# EasyEDA Pro project AquaEye_2025-09-11.epro

# Schematic Esquema 8266
Board Name: Board1; Create Date: 2024-12-06; Page Name: P1; Project Name: AquaEye-Novo; Schematic Name: Esquema; Update Date: 2024-12-06; Company: EasyEDA.com; Drawn: EasyEDA; Page Size: A4; Part Number: JLCPCB-002; Reviewed: EasyEDA; Version: V0.1
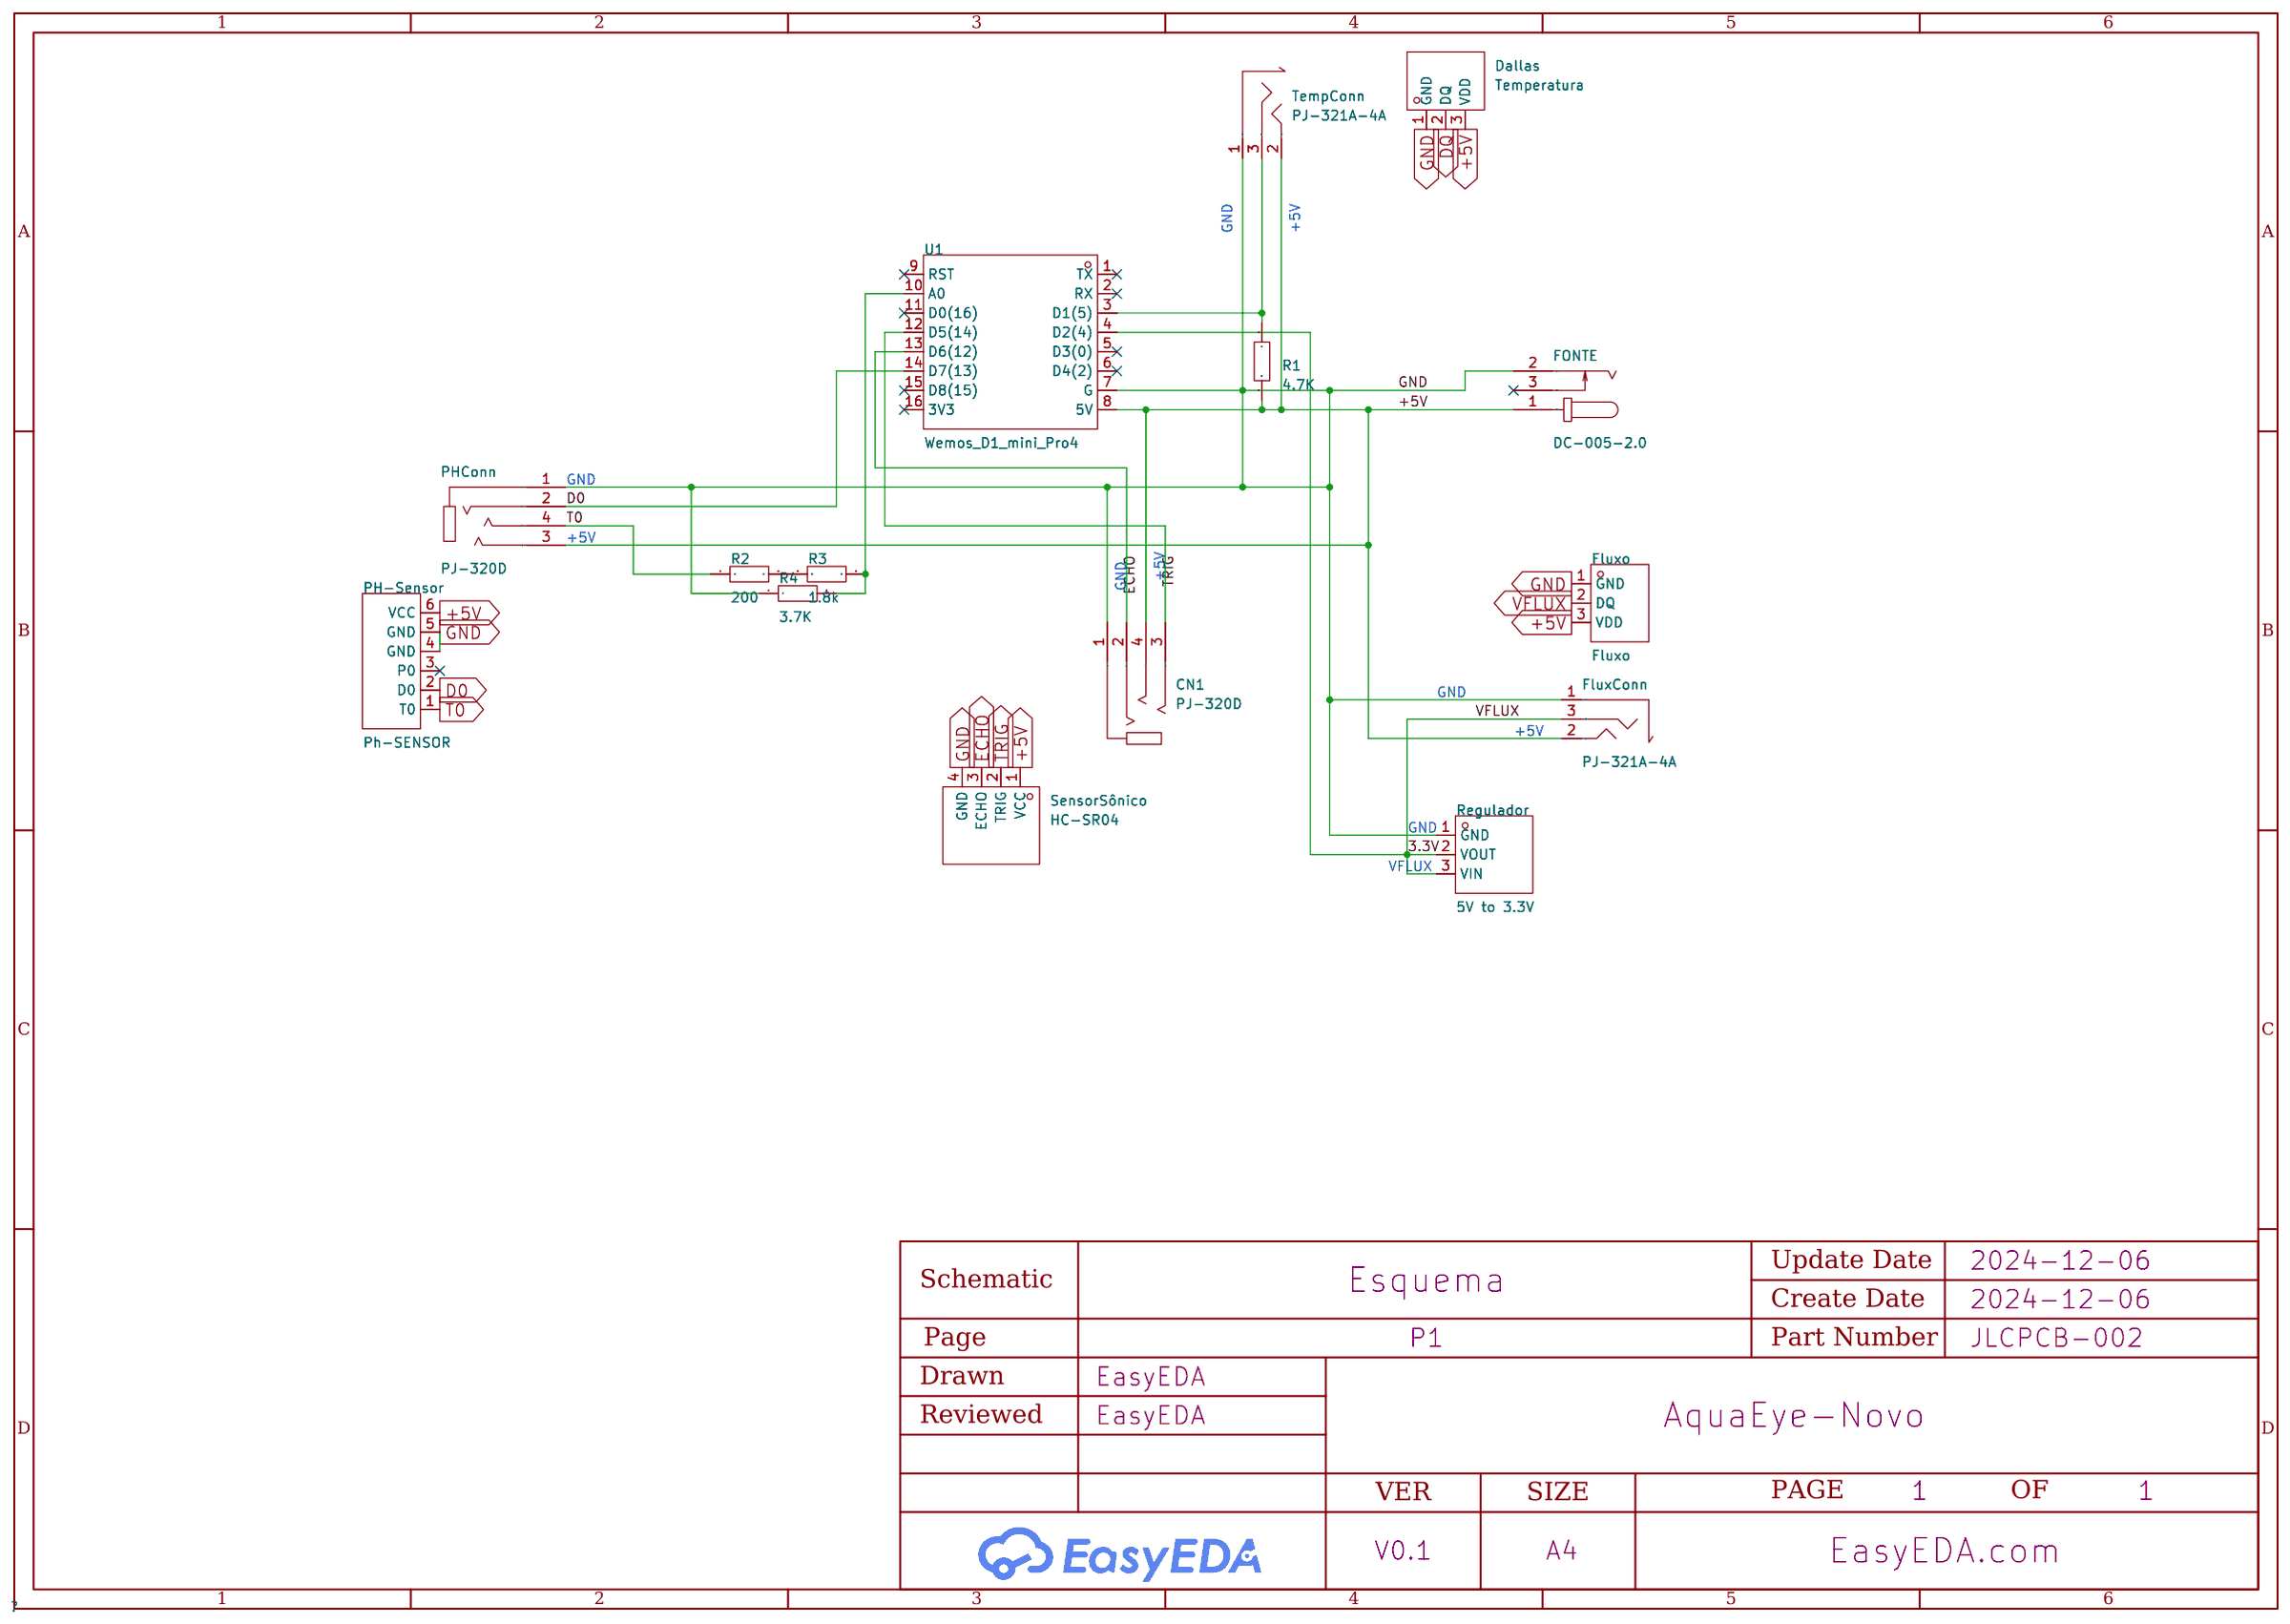
[diagram p0: schematic sheet]

## Parts
CN1  PJ-320D  [AUDIO-SMD_HANELECTRICITY_PJ-320D]
Dallas  Temperatura  [TO-92-SMD_L4.6-W4.6-P1.27_DS18B20]  (no BOM)
FluxConn  PJ-321A-4A  [AUDIO-SMD_PJ-321A-4A]
Fluxo  Fluxo  [TO-92-SMD_L4.6-W4.6-P1.27_DS18B20]  (no BOM)
FONTE  DC-005-2.0  [DC-IN-TH_DC-005-2.0_C22459640]
PH-Sensor  Ph-SENSOR  [PHSENSOR]  (no BOM)
PHConn  PJ-320D  [AUDIO-SMD_HANELECTRICITY_PJ-320D]
R1  4.7K  [R0603]
R2  200  [R0603]
R3  1.8k  [R0603]
R4  3.7K  [R0603]
Regulador  5V to 3.3V  [TO-220-3_L10.0-W4.5-P2.54-L]
SensorSônico  HC-SR04  [TH_HC-SR04V]  (no BOM)
TempConn  PJ-321A-4A  [AUDIO-SMD_PJ-321A-4A]
U1  Wemos_D1_mini_Pro4  [DIP-16_WEMOS_D1_MINI_PRO4]

## Library data of the parts
CN1 PHConn = PJ-320D_C22459515: Supplier Part: C22459515; Manufacturer: HanElectricity(瀚源); Supplier Footprint: SMD; JLCPCB Part Class: Extended Part; Datasheet: https://atta.szlcsc.com/upload/public/pdf/source/20240605/841F5FC54B5C3721768734EDD4CF8D45.pdf; Supplier: LCSC
Dallas Fluxo = DS18B20A10T6: Temperature range:-55℃~+125℃ Temperature range:-55℃~+125℃ Resolution:±0.5℃ Resolution:±0.5℃ Supply Voltage:1.8V~5.5V Supply Voltage:1.8V~5.5V Standby Current:0.2uA Interface Type:-; LCSC Part Name: 数字温度探头; Supplier Part: C22360667; Manufacturer: Mysentech(敏源传感); JLCPCB Part Class: Extended Part; Datasheet: https://atta.szlcsc.com/upload/public/pdf/source/20240403/8816A34B1D539D1E85165E3122908D9D.pdf; Supplier: LCSC; Temperature range: -55℃~+125℃; Resolution: ±0.5℃; Supply Voltage: 1.8V~5.5V; Standby Current: 0.2uA
FluxConn TempConn = PJ-321A-4A: Connector Type:3.5mm耳机座 Current Rating (Max):500mA Voltage Rating (Max):30V Operating Temperature Range:-20℃~+70℃ Operating Temperature Range:-20℃~+70℃; LCSC Part Name: 3.5mm耳机座; Supplier Part: C879743; Manufacturer: 韩国韩荣; Supplier Footprint: SMD; JLCPCB Part Class: Extended Part; Datasheet: https://atta.szlcsc.com/upload/public/pdf/source/20200930/C879743_EC9F86B21DB5E63CC31A951B3CB139C6.pdf; Supplier: LCSC; Connector Type: 3.5mm耳机座; Current Rating (Max): 500mA; Voltage Rating (Max): 30V; Operating Temperature Range: -20℃~+70℃
FONTE = DC-005-2.0_C22459640: Supplier Part: C22459640; Manufacturer: HanElectricity(瀚源); Supplier Footprint: 插件; JLCPCB Part Class: Extended Part; Datasheet: https://atta.szlcsc.com/upload/public/pdf/source/20240612/482A6E3C5A13B157BCBF6F540A12A38A.pdf; Supplier: LCSC
PH-Sensor = Ph-SENSOR
R1-R4 = Res_0603: Supplier Footprint: 0603
Regulador = AMS1117T-1.5: Output Type:-; Supplier Part: C498137; Manufacturer: HGC(华冠); Supplier Footprint: TO-220; JLCPCB Part Class: Extended Part; Datasheet: https://atta.szlcsc.com/upload/public/pdf/source/20200513/C498134_8C21BB131D962146A24408F32965F9BA.pdf; Supplier: LCSC
SensorSônico = HC-SR04: Supplier Part: C19857336; Manufacturer: Universal Microelectronics; JLCPCB Part Class: Extended Part; Datasheet: https://atta.szlcsc.com/upload/public/pdf/source/20240122/47B8E374E428935B7962A2189EF91AAC.pdf; Supplier: LCSC
U1 = Wemos_D1_mini_Pro4: Supplier Part: C2837266; Supplier Footprint: DIP-16; JLCPCB Part Class: Extended Part; Supplier: LCSC

## Nets
3.3V: Regulador.2(VOUT) U1.4(D2(4))
+5V: CN1.4 Dallas.3(VDD) FluxConn.2 Fluxo.3(VDD) FONTE.1 PH-Sensor.6(VCC) PHConn.3 R1.2 SensorSônico.1(VCC) TempConn.2 U1.8(5V)
GND: CN1.1 Dallas.1(GND) FluxConn.1 Fluxo.1(GND) FONTE.2 PH-Sensor.4(GND) PH-Sensor.5(GND) PHConn.1 R4.1 Regulador.1(GND) SensorSônico.4(GND) TempConn.1 U1.7(G)
D0: PH-Sensor.2(D0) PHConn.2 U1.14(D7(13))
DQ: Dallas.2(DQ)
ECHO: CN1.2 SensorSônico.3(ECHO) U1.13(D6(12))
T0: PH-Sensor.1(T0) PHConn.4 R2.1
TRIG: CN1.3 SensorSônico.2(TRIG) U1.12(D5(14))
VFLUX: FluxConn.3 Fluxo.2(DQ) Regulador.3(VIN)
Net-(R1-1): R1.1 TempConn.3 U1.3(D1(5))
Net-(R2-2): R2.2 R3.1
Net-(R3-2): R3.2 R4.2 U1.10(A0)

Not connected (* = marked no-connect by the designer): FONTE 3*; PH-Sensor 3(P0)*; U1 1(TX)* 2(RX)* 5(D3(0))* 6(D4(2))* 9(RST)* 11(D0(16))* 15(D8(15))* 16(3V3)*

## Notes on the sheet
- GND
- +5V
- GND
- +5V
- GND
- +5V
- GND
- +5V
- GND
- VFLUX

# Schematic Schematic2
Board Name: ESP32-C3; Create Date: 2025-08-19; Page Name: v1.0; Project Name: AquaEye-Novo; Schematic Name: Schematic2; Update Date: 2025-09-05; Company: EasyEDA.com; Drawn: EasyEDA; Page Size: A4; Part Number: JLCPCB-002; Reviewed: EasyEDA; Version: V0.1
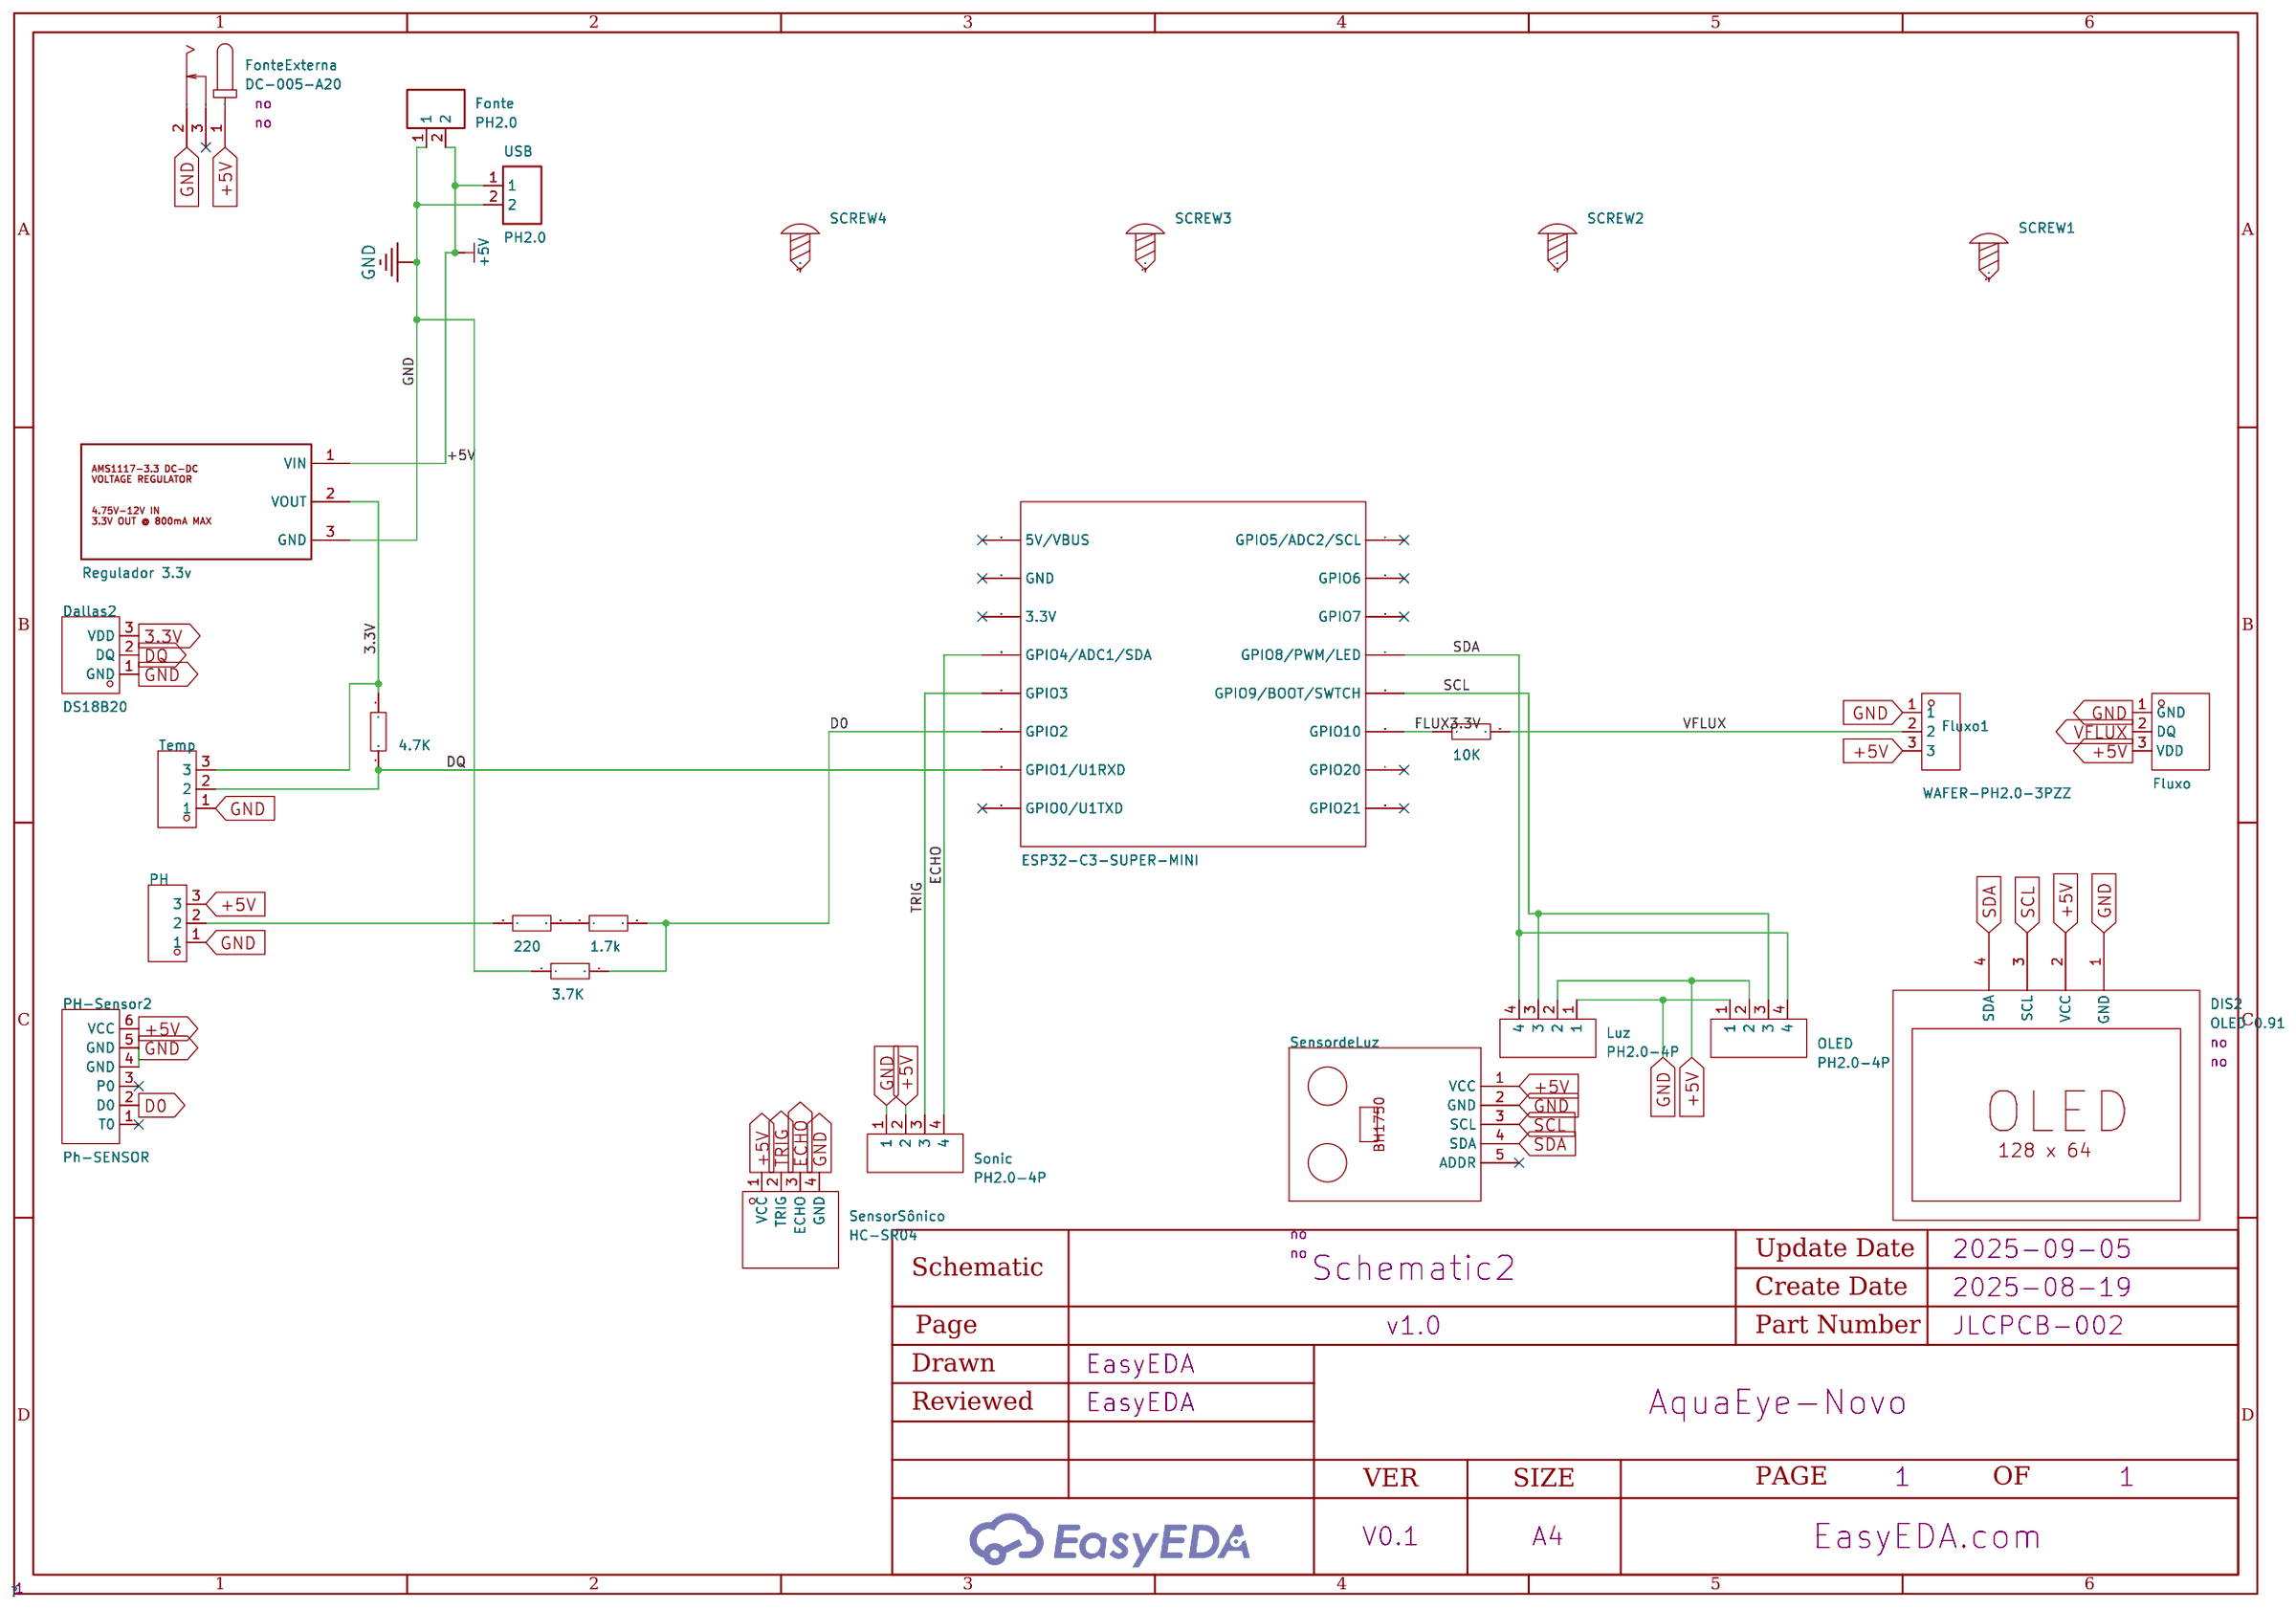
[diagram p1: schematic sheet]

## Parts
Dallas2  DS18B20  [TO-92-3_L4.9-W3.7-P1.27-L]  (no BOM)
DIS2  OLED 0.91  [I2C OLED 0.91]  (no BOM)
Fluxo  Fluxo  [TO-92-SMD_L4.6-W4.6-P1.27_DS18B20]  (no BOM)
Fluxo1  WAFER-PH2.0-3PZZ  [CONN-TH_PH2.0D-L-3P]
Fonte  PH2.0  [CONN-TH_WAFER-PH2.0-2PZZ-Y62]
FonteExterna  DC-005-A20  [DC-IN-TH_DC-005-A200]  (no BOM)
Luz  PH2.0-4P  [CONN-TH_PH2.0-4P]
M1  Regulador 3.3v  [AMS1117-3.3 BUCK CONVERTER BREAKOUT]
OLED  PH2.0-4P  [CONN-TH_PH2.0-4P]
PH  WAFER-PH2.0-3PZZ  [CONN-TH_PH2.0D-L-3P]
PH-Sensor2  Ph-SENSOR  [PHSENSOR]  (no BOM)
R5  10K  [R0603]
R7  220  [R0603]
R8  1.7k  [R0603]
R9  3.7K  [R0603]
SCREW1  -  [Screw-Hole-M2]
SCREW2  -  [Screw-Hole-M2]
SCREW3  -  [Screw-Hole-M2]
SCREW4  -  [Screw-Hole-M2]
SensordeLuz  -  [LIGHT-SENSOR-BH1750]  (no BOM)
SensorSônico  HC-SR04  [TH_HC-SR04V]  (no BOM)
Sonic  PH2.0-4P  [CONN-TH_PH2.0-4P]
Temp  WAFER-PH2.0-3PZZ  [CONN-TH_PH2.0D-L-3P]
U1  4.7K  [R0603]
U2  ESP32-C3-SUPER-MINI  [ESP32-C3-SUPER-MINI]
USB  PH2.0  [CONN-TH_WAFER-PH2.0-2PZZ-Y62]

## Library data of the parts
Dallas2 = DS18B20: Temperature range:-55℃~+125℃ Temperature range:-55℃~+125℃ Resolution:±0.4℃ Resolution:±0.4℃ Supply Voltage:3V~5.5V Supply Voltage:3V~5.5V Standby Current:- Interface Type:-; Supplier Part: C376006; Manufacturer: UMW(友台半导体); Supplier Footprint: TO-92; JLCPCB Part Class: Extended Part; Datasheet: https://atta.szlcsc.com/upload/public/pdf/source/20231109/DC3DA9D47D486EF40A6E0F08B9A498E3.pdf; Supplier: LCSC; Temperature range: -55℃~+125℃; Resolution: ±0.4℃; Supply Voltage: 3V~5.5V; Check: false
DIS2 = OLED 0.91: Manufacturer Part: SSD1306 I2C OLED
Fluxo = DS18B20A10T6: Temperature range:-55℃~+125℃ Temperature range:-55℃~+125℃ Resolution:±0.5℃ Resolution:±0.5℃ Supply Voltage:1.8V~5.5V Supply Voltage:1.8V~5.5V Standby Current:0.2uA Interface Type:-; LCSC Part Name: 数字温度探头; Supplier Part: C22360667; Manufacturer: Mysentech(敏源传感); JLCPCB Part Class: Extended Part; Datasheet: https://atta.szlcsc.com/upload/public/pdf/source/20240403/8816A34B1D539D1E85165E3122908D9D.pdf; Supplier: LCSC; Temperature range: -55℃~+125℃; Resolution: ±0.5℃; Supply Voltage: 1.8V~5.5V; Standby Current: 0.2uA; Check: false
Fluxo1 Temp = WAFER-PH2.0-3PZZ: Pins Structure:1x3P Pitch:2mm Mounting Type:Direct Insert Reference Series:PH Number of Pins:3P Number of Rows:1 Number of PINs Per Row:3 Row Spacing:- Current Rating:2A Contact Material:Brass Contact Plating:Tin Operating Temperature:-25℃~+85℃ Operating; Manufacturer: XUNPU(讯普); Supplier: LCSC; Supplier Part: C5359600; LCSC Part Name: 1x3P 间距:2mm 直插 系列:PH; Supplier Footprint: 插件,P=2mm; JLCPCB Part Class: Extended Part; Datasheet: https://atta.szlcsc.com/upload/public/pdf/source/20241108/09B74E94153224768C62B7F095CB8C18.pdf; Pins Structure: 1x3P; Pitch: 2mm; Mounting Type: Direct Insert; Reference Series: PH; Number of Pins: 3P; Number of Rows: 1; Number of PINs Per Row: 3; Current Rating: 2A; Contact Material: Brass; Contact Plating: Tin; Operating Temperature: -25℃~+85℃; Voltage Rating: 250V; Plastic Material: PA66; Flame Retardant Rating: UL94V-0; Color: White; Z-Height of the Board: 6.05mm; X-Length of Bottom Edge on Board (Spacing Line): 8mm; Y-Width of Bottom Edge on Board: 4.7mm
Fonte USB = PH2.0: Supplier: LCSC; Supplier Part: C42441157; Manufacturer: XUNPU(讯普); Manufacturer Part: WAFER-PH2.0-2PZZ-Y62
FonteExterna = DC-005-A20: Connector Type:DC Power Receptacle Mounting Style:- Inside Contact Diameter:2mm Outside Contact Diameter:6.4mm Current Rating (Max):- Voltage Rating (Max):- Contact Material:- Contact Plating:- Operating Temperature Range:- Operating Temperature Range:- S; LCSC Part Name: DC电源插座 内径:2mm 外径:6.4mm; Supplier Part: C19077752; Manufacturer: Yuandi(元迪); Supplier Footprint: 插件; JLCPCB Part Class: Extended Part; Datasheet: https://atta.szlcsc.com/upload/public/pdf/source/20231020/7887492F275154E63F689B1C5AE32492.pdf; Supplier: LCSC; Connector Type: DC Power Receptacle; Inside Contact Diameter: 2mm; Outside Contact Diameter: 6.4mm
Luz OLED Sonic = PH2.0-4P: Supplier: LCSC; Supplier Part: C722763; Manufacturer: CAX(创都); JLCPCB Part Class: Extended Part
M1 = AMS1117-3.3 DC-DC Voltage Regulator: Supplier: DollaTek on Amazon; link: https://www.amazon.co.uk/gp/product/B07PQPGMZ2/ref=ppx_yo_dt_b_asin_image_o01_s00?ie=UTF8&psc=1
PH = WAFER-PH2.0-3PZZ: Pins Structure:1x3P Pitch:2mm Mounting Type:Direct Insert Reference Series:PH Number of Pins:3P Number of Rows:1 Number of PINs Per Row:3 Row Spacing:- Current Rating:2A Contact Material:Brass Contact Plating:Tin Operating Temperature:-25℃~+85℃ Operating; Manufacturer: XUNPU(讯普); Supplier: LCSC; Supplier Part: C5359600; LCSC Part Name: 1x3P 间距:2mm 直插 系列:PH; Supplier Footprint: 插件,P=2mm; JLCPCB Part Class: Extended Part; Datasheet: https://atta.szlcsc.com/upload/public/pdf/source/20241108/09B74E94153224768C62B7F095CB8C18.pdf; Pins Structure: 1x3P; Pitch: 2mm; Mounting Type: Direct Insert; Number of Pins: 3P; Number of Rows: 1; Number of PINs Per Row: 3; Current Rating: 2A; Contact Material: Brass; Contact Plating: Tin; Operating Temperature: -25℃~+85℃; Voltage Rating: 250V; Plastic Material: PA66; Flame Retardant Rating: UL94V-0; Color: White; Z-Height of the Board: 6.05mm; X-Length of Bottom Edge on Board (Spacing Line): 8mm; Y-Width of Bottom Edge on Board: 4.7mm
PH-Sensor2 = Ph-SENSOR: Check: false
R5 U1 = Res_0603: Supplier Footprint: 0603
R7-R9 = Res_0603: Supplier Footprint: 0603; Check: false
SCREW1-SCREW4 = Screw-Hole-M2: Supplier Footprint: 插件
SensordeLuz = LIGHT-SENSOR-BH1750_
SensorSônico = HC-SR04: Supplier Part: C19857336; Manufacturer: Universal Microelectronics; JLCPCB Part Class: Extended Part; Datasheet: https://atta.szlcsc.com/upload/public/pdf/source/20240122/47B8E374E428935B7962A2189EF91AAC.pdf; Supplier: LCSC; Check: false
U2 = ESP32-C3-SUPER-MINI: Manufacturer: Maker go; link: https://www.tindie.com/products/adz1122/esp32-c3-development-board-esp32-supermini/

## Nets
3.3V: Dallas2.3(VDD) M1.2(VOUT) Temp.3 U1.2
+5V: DIS2.2(VCC) Fluxo.3(VDD) Fluxo1.3 Fonte.2 FonteExterna.1 Luz.2 M1.1(VIN) OLED.2 PH.3 PH-Sensor2.6(VCC) SensordeLuz.1(VCC) SensorSônico.1(VCC) Sonic.2 USB.1
GND: Dallas2.1(GND) DIS2.1(GND) Fluxo.1(GND) Fluxo1.1 Fonte.1 FonteExterna.2 Luz.1 M1.3(GND) OLED.1 PH.1 PH-Sensor2.4(GND) PH-Sensor2.5(GND) R9.1 SensordeLuz.2(GND) SensorSônico.4(GND) Sonic.1 Temp.1 USB.2
D0: PH-Sensor2.2(D0) R8.2 R9.2 U2.11(GPIO2)
DQ: Dallas2.2(DQ) Temp.2 U1.1 U2.10(GPIO1/U1RXD)
ECHO: SensorSônico.3(ECHO) Sonic.4 U2.13(GPIO4/ADC1/SDA)
FLUX3.3V: R5.1 U2.6(GPIO10)
SCL: DIS2.3(SCL) Luz.3 OLED.3 SensordeLuz.3(SCL) U2.5(GPIO9/BOOT/SWTCH)
SDA: DIS2.4(SDA) Luz.4 OLED.4 SensordeLuz.4(SDA) U2.4(GPIO8/PWM/LED)
TRIG: SensorSônico.2(TRIG) Sonic.3 U2.12(GPIO3)
VFLUX: Fluxo.2(DQ) Fluxo1.2 R5.2
$2N1692: R7.2 R8.1
$2N3634: PH.2 R7.1

Not connected (* = marked no-connect by the designer): FonteExterna 3*; PH-Sensor2 1(T0)* 3(P0)*; SCREW1 1; SCREW2 1; SCREW3 1; SCREW4 1; SensordeLuz 5(ADDR)*; U2 1(GPIO5/ADC2/SCL)* 2(GPIO6)* 3(GPIO7)* 7(GPIO20)* 8(GPIO21)* 9(GPIO0/U1TXD)* 14(3.3V)* 15(GND)* 16(5V/VBUS)*

# Schematic Schematic-ProtGemini
Board Name: ESP32-C3 - Proteção Gemini; Create Date: 2025-09-07; Page Name: 1x TPS2553; Project Name: AquaEye-Novo; Schematic Name: Schematic-ProtGemini; Update Date: 2025-09-07; Company: EasyEDA.com; Drawn: EasyEDA; Page Size: A4; Part Number: JLCPCB-002; Reviewed: EasyEDA; Version: V0.1
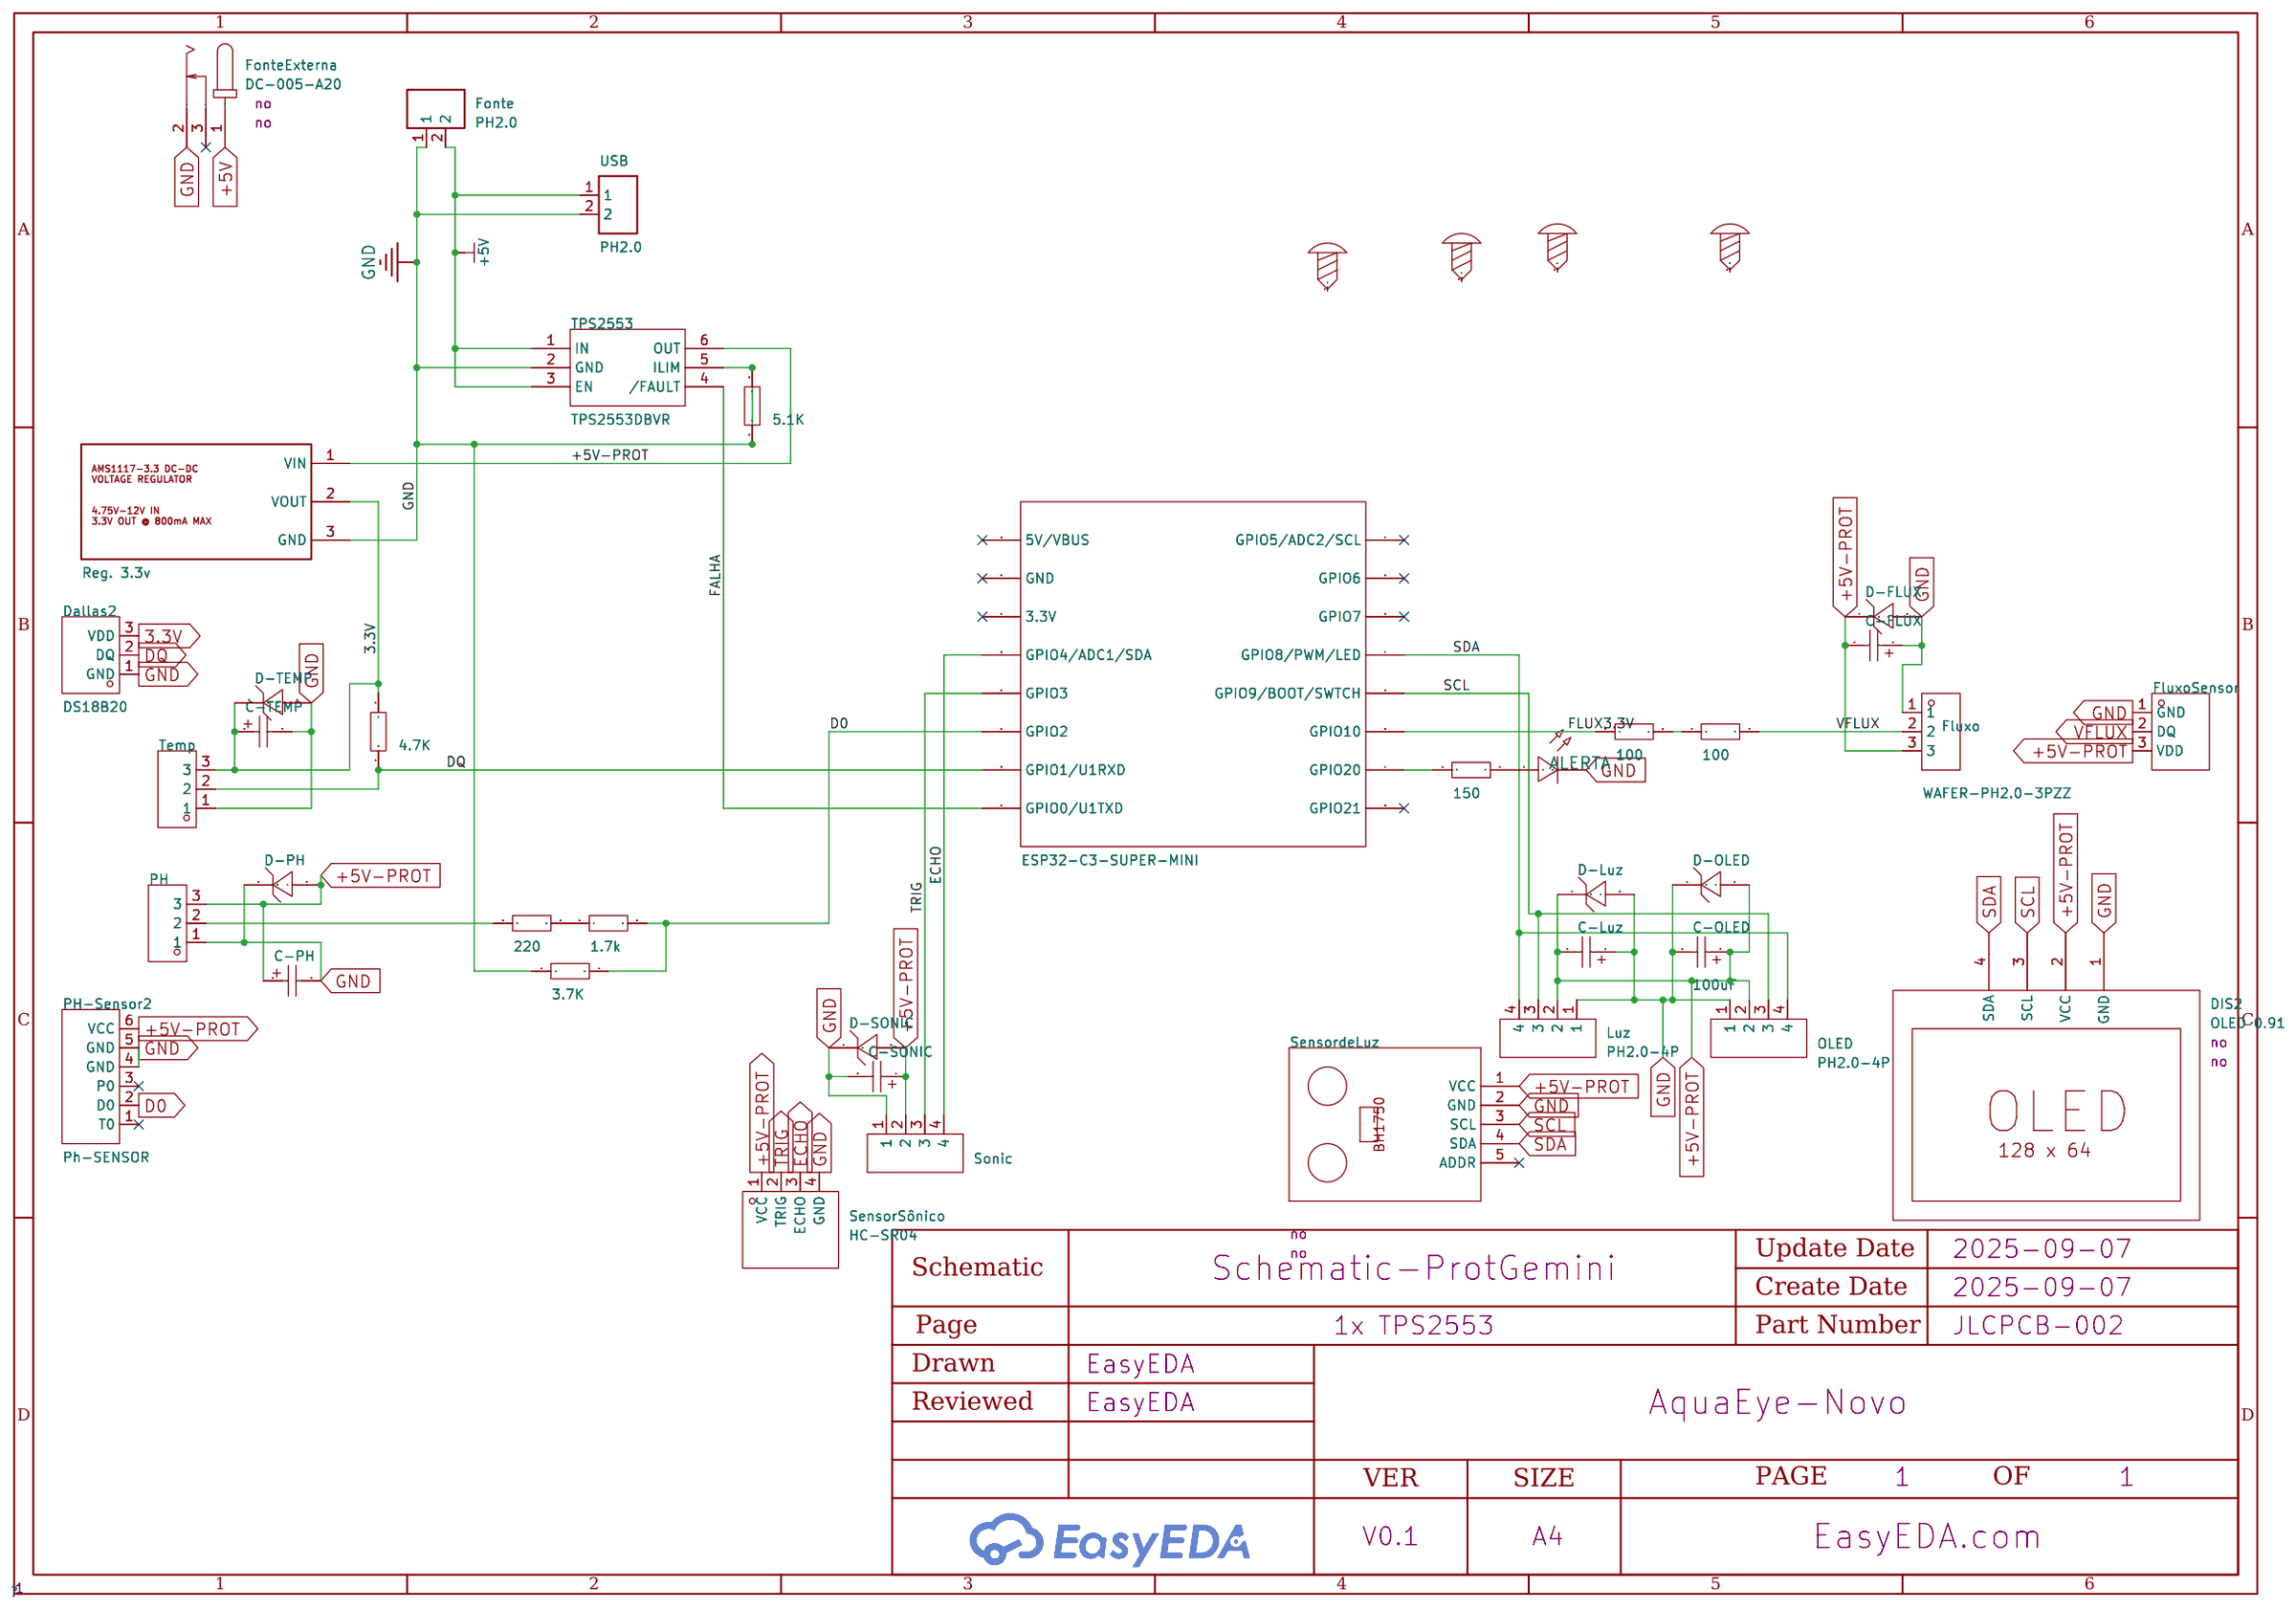
[diagram p2: schematic sheet]

## Parts
ALERTA  -  [LED0805-R-RD]
C-FLUX  100uF  [CAP-SMD_BD3.0-L3.3-W3.3-RD]
C-Luz  100uF  [CAP-SMD_BD3.0-L3.3-W3.3-RD]
C-OLED  100uF  [CAP-SMD_BD3.0-L3.3-W3.3-RD]
C-PH  100uF  [CAP-SMD_BD3.0-L3.3-W3.3-RD]
C-SONIC  100uF  [CAP-SMD_BD3.0-L3.3-W3.3-RD]
C-TEMP  100uF  [CAP-SMD_BD3.0-L3.3-W3.3-RD]
D-FLUX  SMAJ5.0A  [SMA_L4.3-W2.6-LS5.2-RD]
D-Luz  SMAJ5.0A  [SMA_L4.3-W2.6-LS5.2-RD]
D-OLED  SMAJ5.0A  [SMA_L4.3-W2.6-LS5.2-RD]
D-PH  SMAJ5.0A  [SMA_L4.3-W2.6-LS5.2-RD]
D-SONIC  SMAJ5.0A  [SMA_L4.3-W2.6-LS5.2-RD]
D-TEMP  SMAJ5.0A  [SMA_L4.3-W2.6-LS5.2-RD]
Dallas2  DS18B20  [TO-92-3_L4.9-W3.7-P1.27-L]  (no BOM)
DIS2  OLED 0.91  [I2C OLED 0.91]  (no BOM)
Fluxo  WAFER-PH2.0-3PZZ  [CONN-TH_PH2.0D-L-3P]
FluxoSensor  DS18B20A10T6  [TO-92-SMD_L4.6-W4.6-P1.27_DS18B20]  (no BOM)
Fonte  PH2.0  [CONN-TH_WAFER-PH2.0-2PZZ-Y62]
FonteExterna  DC-005-A20  [DC-IN-TH_DC-005-A200]  (no BOM)
Luz  PH2.0-4P  [CONN-TH_PH2.0-4P]
M1  Reg. 3.3v  [AMS1117-3.3 BUCK CONVERTER BREAKOUT]
OLED  PH2.0-4P  [CONN-TH_PH2.0-4P]
PH  WAFER-PH2.0-3PZZ  [CONN-TH_PH2.0D-L-3P]
PH-Sensor2  Ph-SENSOR  [PHSENSOR]  (no BOM)
R5  100  [R0603]
R7  220  [R0603]
R8  1.7k  [R0603]
R9  3.7K  [R0603]
R10  100  [R0603]
SCREW1  -  [Screw-Hole-M2]
SCREW2  -  [Screw-Hole-M2]
SCREW3  -  [Screw-Hole-M2]
SCREW4  -  [Screw-Hole-M2]
SensordeLuz  -  [LIGHT-SENSOR-BH1750]  (no BOM)
SensorSônico  HC-SR04  [TH_HC-SR04V]  (no BOM)
Sonic  PH2.0-4P  [CONN-TH_PH2.0-4P]
Temp  WAFER-PH2.0-3PZZ  [CONN-TH_PH2.0D-L-3P]
TPS2553  TPS2553DBVR  [SOT-23-6_L2.9-W1.6-P0.95-LS2.8-BR]
U1  4.7K  [R0603]
U2  ESP32-C3-SUPER-MINI  [ESP32-C3-SUPER-MINI]
U3  5.1K  [R0603]
U4  150  [R0603]
USB  PH2.0  [CONN-TH_WAFER-PH2.0-2PZZ-Y62]

## Library data of the parts
ALERTA = LED_0805-R: Supplier Footprint: 0805
C-FLUX C-Luz C-OLED C-PH C-SONIC C-TEMP = C_Ele_SMD_3x5.4mm: Supplier Footprint: SMD,3x5.4mm
D-FLUX D-Luz D-OLED D-PH D-SONIC D-TEMP = SMAJ5.0A: Reverse Stand-Off Voltage (Vrwm):5V Maximum Clamping Voltage:9.2V Peak Pulse Current (Ipp)@10/1000us:43.5A Breakdown Voltage:6.4V Type:TVS; LCSC Part Name: 单向TVS 5V截止 43.5A峰值脉冲; Supplier Part: C132575; Supplier Footprint: SMA(DO-214AC); Datasheet: https://atta.szlcsc.com/upload/public/pdf/source/20180726/C236400_045E05B60F075B360360EE470465B436.pdf; Supplier: LCSC; Reverse Stand-Off Voltage (Vrwm): 5V; Maximum Clamping Voltage: 9.2V; Peak Pulse Current (Ipp)@10/1000us: 43.5A; Breakdown Voltage: 6.4V; Type: TVS
Dallas2 = DS18B20: Temperature range:-55℃~+125℃ Temperature range:-55℃~+125℃ Resolution:±0.4℃ Resolution:±0.4℃ Supply Voltage:3V~5.5V Supply Voltage:3V~5.5V Standby Current:- Interface Type:-; Supplier Part: C376006; Manufacturer: UMW(友台半导体); Supplier Footprint: TO-92; JLCPCB Part Class: Extended Part; Datasheet: https://atta.szlcsc.com/upload/public/pdf/source/20231109/DC3DA9D47D486EF40A6E0F08B9A498E3.pdf; Supplier: LCSC; Temperature range: -55℃~+125℃; Resolution: ±0.4℃; Supply Voltage: 3V~5.5V; Check: false
DIS2 = OLED 0.91: Manufacturer Part: SSD1306 I2C OLED
Fluxo Temp = WAFER-PH2.0-3PZZ: Pins Structure:1x3P Pitch:2mm Mounting Type:Direct Insert Reference Series:PH Number of Pins:3P Number of Rows:1 Number of PINs Per Row:3 Row Spacing:- Current Rating:2A Contact Material:Brass Contact Plating:Tin Operating Temperature:-25℃~+85℃ Operating; Manufacturer: XUNPU(讯普); Supplier: LCSC; Supplier Part: C5359600; LCSC Part Name: 1x3P 间距:2mm 直插 系列:PH; Supplier Footprint: 插件,P=2mm; JLCPCB Part Class: Extended Part; Datasheet: https://atta.szlcsc.com/upload/public/pdf/source/20241108/09B74E94153224768C62B7F095CB8C18.pdf; Pins Structure: 1x3P; Pitch: 2mm; Mounting Type: Direct Insert; Reference Series: PH; Number of Pins: 3P; Number of Rows: 1; Number of PINs Per Row: 3; Current Rating: 2A; Contact Material: Brass; Contact Plating: Tin; Operating Temperature: -25℃~+85℃; Voltage Rating: 250V; Plastic Material: PA66; Flame Retardant Rating: UL94V-0; Color: White; Z-Height of the Board: 6.05mm; X-Length of Bottom Edge on Board (Spacing Line): 8mm; Y-Width of Bottom Edge on Board: 4.7mm
FluxoSensor = DS18B20A10T6: Temperature range:-55℃~+125℃ Temperature range:-55℃~+125℃ Resolution:±0.5℃ Resolution:±0.5℃ Supply Voltage:1.8V~5.5V Supply Voltage:1.8V~5.5V Standby Current:0.2uA Interface Type:-; LCSC Part Name: 数字温度探头; Supplier Part: C22360667; Manufacturer: Mysentech(敏源传感); JLCPCB Part Class: Extended Part; Datasheet: https://atta.szlcsc.com/upload/public/pdf/source/20240403/8816A34B1D539D1E85165E3122908D9D.pdf; Supplier: LCSC; Temperature range: -55℃~+125℃; Resolution: ±0.5℃; Supply Voltage: 1.8V~5.5V; Standby Current: 0.2uA; Check: false
Fonte USB = PH2.0: Supplier: LCSC; Supplier Part: C42441157; Manufacturer: XUNPU(讯普); Manufacturer Part: WAFER-PH2.0-2PZZ-Y62
FonteExterna = DC-005-A20: Connector Type:DC Power Receptacle Mounting Style:- Inside Contact Diameter:2mm Outside Contact Diameter:6.4mm Current Rating (Max):- Voltage Rating (Max):- Contact Material:- Contact Plating:- Operating Temperature Range:- Operating Temperature Range:- S; LCSC Part Name: DC电源插座 内径:2mm 外径:6.4mm; Supplier Part: C19077752; Manufacturer: Yuandi(元迪); Supplier Footprint: 插件; JLCPCB Part Class: Extended Part; Datasheet: https://atta.szlcsc.com/upload/public/pdf/source/20231020/7887492F275154E63F689B1C5AE32492.pdf; Supplier: LCSC; Connector Type: DC Power Receptacle; Inside Contact Diameter: 2mm; Outside Contact Diameter: 6.4mm
Luz OLED Sonic = PH2.0-4P: Supplier: LCSC; Supplier Part: C722763; Manufacturer: CAX(创都); JLCPCB Part Class: Extended Part
M1 = AMS1117-3.3 DC-DC Voltage Regulator: Supplier: DollaTek on Amazon; link: https://www.amazon.co.uk/gp/product/B07PQPGMZ2/ref=ppx_yo_dt_b_asin_image_o01_s00?ie=UTF8&psc=1
PH = WAFER-PH2.0-3PZZ: Pins Structure:1x3P Pitch:2mm Mounting Type:Direct Insert Reference Series:PH Number of Pins:3P Number of Rows:1 Number of PINs Per Row:3 Row Spacing:- Current Rating:2A Contact Material:Brass Contact Plating:Tin Operating Temperature:-25℃~+85℃ Operating; Manufacturer: XUNPU(讯普); Supplier: LCSC; Supplier Part: C5359600; LCSC Part Name: 1x3P 间距:2mm 直插 系列:PH; Supplier Footprint: 插件,P=2mm; JLCPCB Part Class: Extended Part; Datasheet: https://atta.szlcsc.com/upload/public/pdf/source/20241108/09B74E94153224768C62B7F095CB8C18.pdf; Pins Structure: 1x3P; Pitch: 2mm; Mounting Type: Direct Insert; Number of Pins: 3P; Number of Rows: 1; Number of PINs Per Row: 3; Current Rating: 2A; Contact Material: Brass; Contact Plating: Tin; Operating Temperature: -25℃~+85℃; Voltage Rating: 250V; Plastic Material: PA66; Flame Retardant Rating: UL94V-0; Color: White; Z-Height of the Board: 6.05mm; X-Length of Bottom Edge on Board (Spacing Line): 8mm; Y-Width of Bottom Edge on Board: 4.7mm
PH-Sensor2 = Ph-SENSOR: Check: false
R5 R10 U1 U3 U4 = Res_0603: Supplier Footprint: 0603
R7-R9 = Res_0603: Supplier Footprint: 0603; Check: false
SCREW1-SCREW4 = Screw-Hole-M2: Supplier Footprint: 插件
SensordeLuz = LIGHT-SENSOR-BH1750_
SensorSônico = HC-SR04: Supplier Part: C19857336; Manufacturer: Universal Microelectronics; JLCPCB Part Class: Extended Part; Datasheet: https://atta.szlcsc.com/upload/public/pdf/source/20240122/47B8E374E428935B7962A2189EF91AAC.pdf; Supplier: LCSC; Check: false
TPS2553 = TPS2553DBVR: Type:High-side switch Number of Channels:1 Control Input Logic:Active High Output Current:1.5A Voltage - Supply:2.5V~6.5V Voltage - Supply:2.5V~6.5V RDS(on):85mΩ Operating Temperature	-:-40℃~+150℃ Operating Temperature	-:-40℃~+150℃; LCSC Part Name: 精密可调限流电源分配开关; Supplier Part: C55266; Manufacturer: TI(德州仪器); Supplier Footprint: SOT-23-6; JLCPCB Part Class: Extended Part; Datasheet: https://www.ti.com/cn/lit/gpn/tps2553; Supplier: LCSC; Type: High-side switch; Number of Channels: 1; Control Input Logic: Active High; Output Current: 1.5A; Voltage - Supply: 2.5V~6.5V; RDS(on): 85mΩ; Operating Temperature	-: -40℃~+150℃
U2 = ESP32-C3-SUPER-MINI: Manufacturer: Maker go; link: https://www.tindie.com/products/adz1122/esp32-c3-development-board-esp32-supermini/

## Nets
3.3V: C-TEMP.1 D-TEMP.1(C) Dallas2.3(VDD) M1.2(VOUT) Temp.3 U1.2
+5V: Fonte.2 FonteExterna.1 TPS2553.1(IN) TPS2553.3(EN) USB.1
+5V-PROT: C-FLUX.2 C-Luz.2 C-OLED.1 C-PH.1 C-SONIC.1 D-FLUX.1(C) D-Luz.1(C) D-OLED.2(A) D-PH.2(A) D-SONIC.2(A) DIS2.2(VCC) Fluxo.3 FluxoSensor.3(VDD) Luz.2 M1.1(VIN) OLED.2 PH.3 PH-Sensor2.6(VCC) SensordeLuz.1(VCC) SensorSônico.1(VCC) Sonic.2 TPS2553.6(OUT)
GND: ALERTA.2(C) C-FLUX.1 C-Luz.1 C-OLED.2 C-PH.2 C-SONIC.2 C-TEMP.2 D-FLUX.2(A) D-Luz.2(A) D-OLED.1(C) D-PH.1(C) D-SONIC.1(C) D-TEMP.2(A) Dallas2.1(GND) DIS2.1(GND) Fluxo.1 FluxoSensor.1(GND) Fonte.1 FonteExterna.2 Luz.1 M1.3(GND) OLED.1 PH.1 PH-Sensor2.4(GND) PH-Sensor2.5(GND) R9.1 SensordeLuz.2(GND) SensorSônico.4(GND) Sonic.1 Temp.1 TPS2553.2(GND) TPS2553.5(ILIM) U3.1 U3.2 USB.2
D0: PH-Sensor2.2(D0) R8.2 R9.2 U2.11(GPIO2)
DQ: Dallas2.2(DQ) Temp.2 U1.1 U2.10(GPIO1/U1RXD)
ECHO: SensorSônico.3(ECHO) Sonic.4 U2.13(GPIO4/ADC1/SDA)
FALHA: TPS2553.4(/FAULT) U2.9(GPIO0/U1TXD)
FLUX3.3V: R5.1 U2.6(GPIO10)
SCL: DIS2.3(SCL) Luz.3 OLED.3 SensordeLuz.3(SCL) U2.5(GPIO9/BOOT/SWTCH)
SDA: DIS2.4(SDA) Luz.4 OLED.4 SensordeLuz.4(SDA) U2.4(GPIO8/PWM/LED)
TRIG: SensorSônico.2(TRIG) Sonic.3 U2.12(GPIO3)
VFLUX: Fluxo.2 FluxoSensor.2(DQ) R10.2
$2N1692: R7.2 R8.1
$2N3634: PH.2 R7.1
$2N15099: U2.7(GPIO20) U4.2
$2N15124: ALERTA.1(A) U4.1
$2N15188: R5.2 R10.1

Not connected (* = marked no-connect by the designer): FonteExterna 3*; PH-Sensor2 1(T0)* 3(P0)*; SCREW1 1; SCREW2 1; SCREW3 1; SCREW4 1; SensordeLuz 5(ADDR)*; U2 1(GPIO5/ADC2/SCL)* 2(GPIO6)* 3(GPIO7)* 8(GPIO21)* 14(3.3V)* 15(GND)* 16(5V/VBUS)*

# Board PCB15
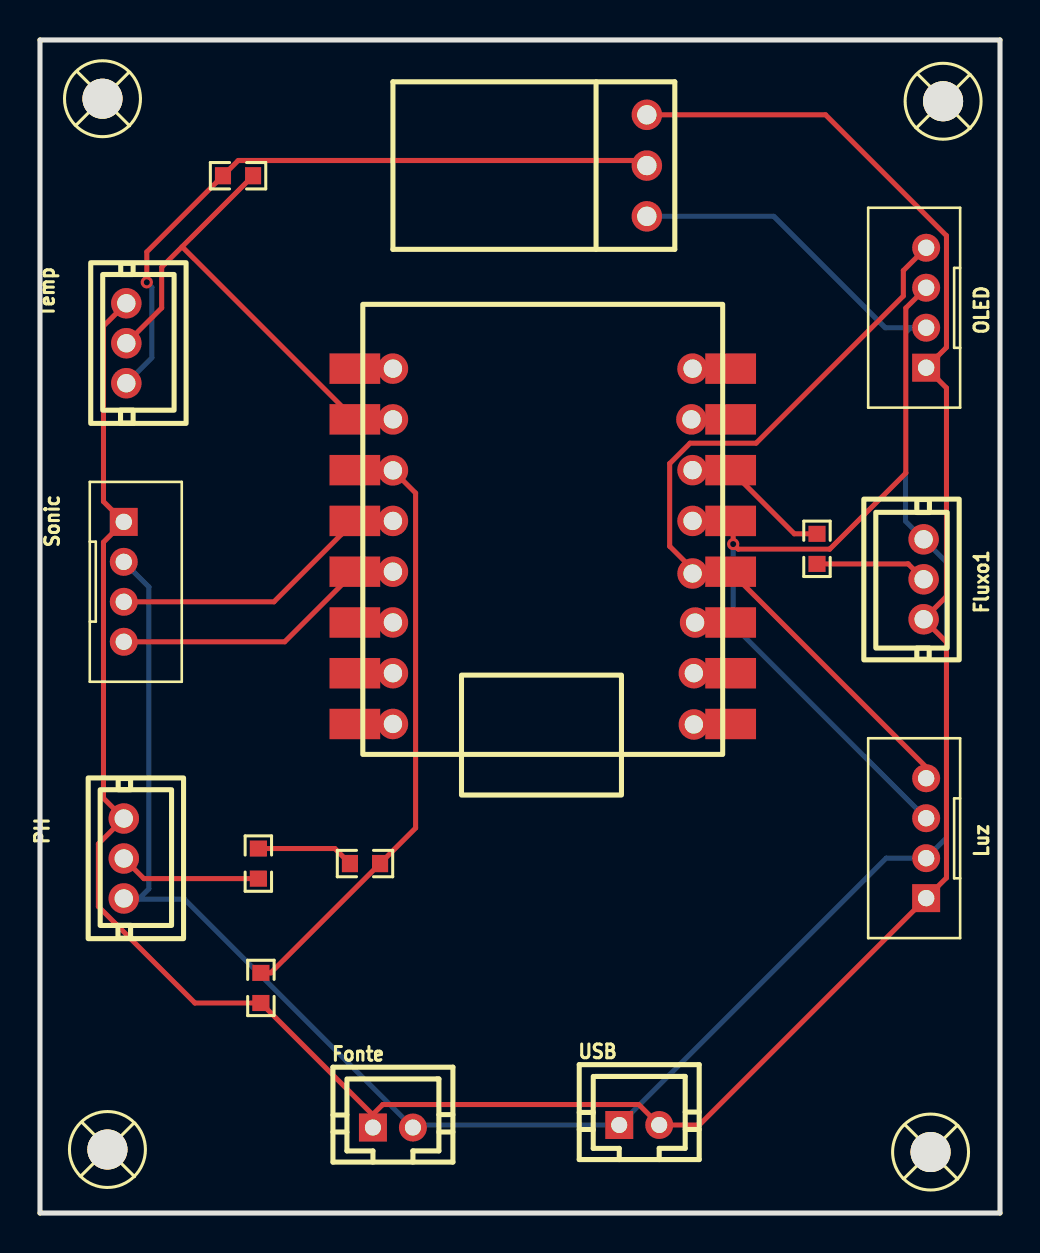
[diagram p3: board, top side]
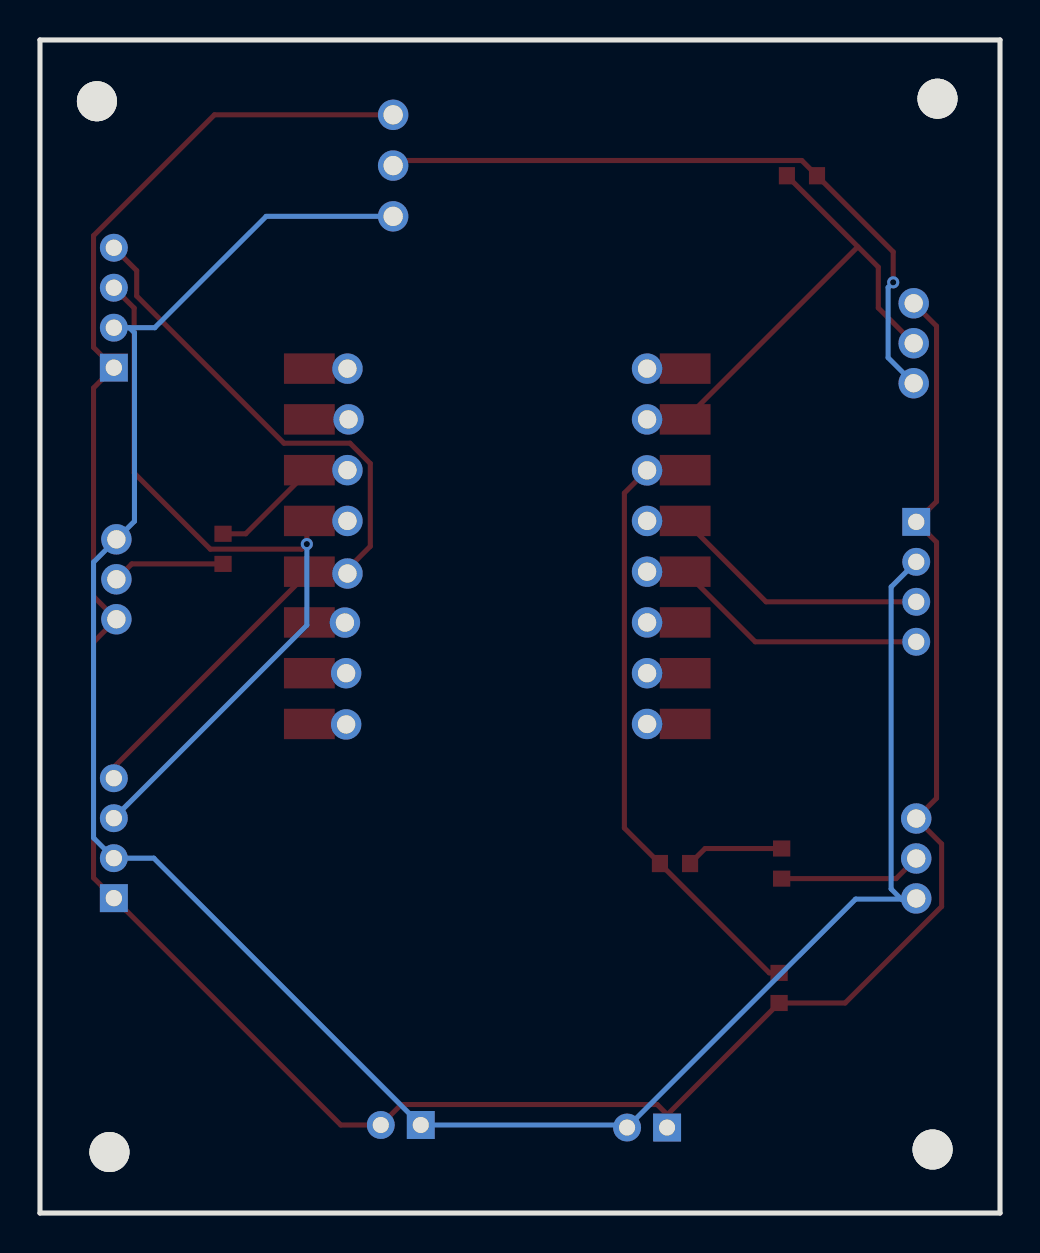
[diagram p4: board, bottom side, seen from below]

Outline 48.02 x 58.7 mm; copper layers: Top Layer, Bottom Layer. Coordinates in mm from the lower left corner of the outline.
Outline path: 0,58.7 48.02,58.7 48.02,0 0,0 0,58.7
Stack: Top Layer 0.035mm / Dielectric1 1.51mm FR4 er 4.5 / Bottom Layer 0.035mm

## Design rules (mm)
template: JLCPCB Capability(Two Layers Board)
spacing copperThickness1oz (default): track to track 0.102, other pairs 0.152 to 0.3
spacing copperThickness2oz: track to track 0.203, other pairs 0.152 to 0.3
track width copperThickness1oz (default): min 0.127, default 0.254, max 2.54
track width copperThickness2oz: min 0.203, default 0.254, max 2.54
differential pair differentialPair (default): width min 0.127, default 0.254, max 2.54; gap min 0.152, default 0.152
via viaSize (default): diameter min 0.5, default 0.61, max 10; hole min 0.3, default 0.305, max 6.3

## Placement (name value [footprint] x y rotation side)
Fluxo1  WAFER-PH2.0-3PZZ  [CONN-TH_PH2.0D-L-3P]  44.2 31.71 90 top
Fonte  PH2.0  [CONN-TH_WAFER-PH2.0-2PZZ-Y62]  17.65 4.28 0 top
Luz  PH2.0-4P  [CONN-TH_PH2.0-4P]  44.32 18.76 90 top
M1  Regulador 3.3v  [AMS1117-3.3 BUCK CONVERTER BREAKOUT]  27.81 52.41 90 top
NOREF  -  [Pad_e2]  17.65 42.25 0 top
NOREF#2  -  [Pad_e19]  32.58 39.71 0 top
NOREF#3  -  [Pad_e27]  32.64 34.63 0 top
NOREF#4  -  [Pad_e24]  32.64 37.17 0 top
NOREF#5  -  [Pad_e32]  32.77 29.55 0 top
NOREF#6  -  [Pad_e35]  32.7 24.45 0 top
NOREF#7  -  [Pad_e28]  32.64 32 0 top
NOREF#8  -  [Pad_e4]  32.64 42.25 0 top
NOREF#9  -  [Pad_e33]  17.65 27.01 0 top
NOREF#10  -  [Pad_e36]  17.65 24.47 0 top
NOREF#11  -  [Pad_e23]  17.65 37.16 0 top
NOREF#12  -  [Pad_e29]  17.65 32.09 0 top
NOREF#13  -  [Pad_e34]  32.7 27.01 0 top
NOREF#14  -  [Pad_e18]  17.65 39.71 0 top
NOREF#15  -  [Pad_e26]  17.65 34.63 0 top
NOREF#16  -  [Pad_e31]  17.65 29.55 0 top
OLED  PH2.0-4P  [CONN-TH_PH2.0-4P]  44.32 45.3 90 top
PH  WAFER-PH2.0-3PZZ  [CONN-TH_PH2.0D-L-3P]  4.19 17.74 270 top
R5  10K  [R0603]  38.86 33.23 270 top
R7  220  [R0603]  10.92 17.49 90 top
R8  1.7k  [R0603]  16.26 17.49 0 top
R9  3.7K  [R0603]  11.05 11.26 90 top
SCREW1  -  [Screw-Hole-M2]  44.54 3.05 0 top
SCREW2  -  [Screw-Hole-M2]  45.17 55.63 0 top
SCREW3  -  [Screw-Hole-M2]  3.13 55.76 0 top
SCREW4  -  [Screw-Hole-M2]  3.37 3.18 0 top
Sonic  PH2.0-4P  [CONN-TH_PH2.0-4P]  4.19 31.58 270 top
Temp  WAFER-PH2.0-3PZZ  [CONN-TH_PH2.0D-L-3P]  4.32 43.52 270 top
U1  4.7K  [R0603]  9.91 51.9 180 top
U2  -  [ESP32-C3-SUPER-MINI]  25.15 32.6 180 top
USB  PH2.0  [CONN-TH_WAFER-PH2.0-2PZZ-Y62]  29.97 4.41 0 top

## Footprints (pads in the part's own frame, mm; a bottom-side part is the same pattern mirrored in y, then rotated)
AMS1117-3.3 BUCK CONVERTER BREAKOUT
  round 1.524 hole 0.965: 1(-2.54,-2.54) 2(0,-2.54) 3(2.54,-2.54)
CONN-TH_PH2.0-4P
  rect 1.4x1.4 hole 0.813: 1(-3,0)
  round 1.4 hole 0.813: 2(-1,0) 3(1,0) 4(3,0)
CONN-TH_PH2.0D-L-3P
  round 1.524 hole 0.914: 1(-2,0) 2(0,0) 3(2,0)
CONN-TH_WAFER-PH2.0-2PZZ-Y62
  rect 1.4x1.4 hole 0.8: 1(-1,0)
  round 1.4 hole 0.8: 2(1,0)
ESP32-C3-SUPER-MINI
  rect 2.54x1.524 smd: 1(-9.398,8.128) 2(-9.398,5.588) 3(-9.398,3.048) 4(-9.398,0.508) 5(-9.398,-2.032) 6(-9.398,-4.572) 7(-9.398,-7.112) 8(-9.398,-9.652) 9(9.398,-9.652) 10(9.398,-7.112) 11(9.398,-4.572) 12(9.398,-2.032) 13(9.398,0.508) 14(9.398,3.048) 15(9.398,5.588) 16(9.398,8.128)
Pad_e2
  round 1.524 hole 0.914: 1(0,0)
Pad_e4
  round 1.524 hole 0.914: 2(0,0)
Pad_e18
  round 1.524 hole 0.914: 1(0,0)
Pad_e19
  round 1.524 hole 0.914: 2(0,0)
Pad_e23
  round 1.524 hole 0.914: 1(0,0)
Pad_e24
  round 1.524 hole 0.914: 2(0,0)
Pad_e26
  round 1.524 hole 0.914: 1(0,0)
Pad_e27
  round 1.524 hole 0.914: 2(0,0)
Pad_e28
  round 1.524 hole 0.914: 3(0,0)
Pad_e29
  round 1.524 hole 0.914: 4(0,0)
Pad_e31
  round 1.524 hole 0.914: 1(0,0)
Pad_e32
  round 1.524 hole 0.914: 2(0,0)
Pad_e33
  round 1.524 hole 0.914: 3(0,0)
Pad_e34
  round 1.524 hole 0.914: 4(0,0)
Pad_e35
  round 1.524 hole 0.914: 5(0,0)
Pad_e36
  round 1.524 hole 0.914: 6(0,0)
R0603
  rect 0.806x0.864 smd: 1(-0.753,0) 2(0.753,0)
Screw-Hole-M2
  round 2 hole 2: 1(0,0)

## Nets
3.3V: M1.2 Temp.3 U1.2
+5V: Fluxo1.3 Fonte.2 Luz.2 M1.1 OLED.2 PH.3 Sonic.2 USB.1
GND: Fluxo1.1 Fonte.1 Luz.1 M1.3 OLED.1 PH.1 R9.1 Sonic.1 Temp.1 USB.2
D0: NOREF#11.1 R8.2 R9.2 U2.11
DQ: NOREF#14.1 Temp.2 U1.1 U2.10
ECHO: NOREF#12.4 Sonic.4 U2.13
FLUX3.3V: NOREF#4.2 R5.1 U2.6
SCL: Luz.3 NOREF#3.2 OLED.3 U2.5
SDA: Luz.4 NOREF#7.3 OLED.4 U2.4
TRIG: NOREF#15.1 Sonic.3 U2.12
VFLUX: Fluxo1.2 R5.2
$2N1692: R7.2 R8.1
$2N3634: PH.2 R7.1

Pads without a net: NOREF 1; NOREF#2 2; NOREF#5 2; NOREF#6 5; NOREF#8 2; NOREF#9 3; NOREF#10 6; NOREF#13 4; NOREF#16 1; SCREW1 1; SCREW2 1; SCREW3 1; SCREW4 1; U2 1 2 3 7 8 9 14 15 16

## Via types
v1: diameter 0.61, hole 0.305, Top Layer to Bottom Layer, 2 vias

## Routing (per net, layer and track width the routed paths; a pad name or vN(x,y) marks a point on that pad's centre or on a via; arc(x,y) is an arc through that point)
3.3V: length 34.2
  Top Layer w0.254: M1.2 30.1,52.67 9.91,52.67 U1.2 5.34,48.09 v1(5.34,46.57)
  Bottom Layer w0.254: v1(5.34,46.57) 5.6,46.31 5.6,42.8 Temp.3
+5V: length 112.3
  Bottom Layer w0.254: 4.94,15.71 7.22,15.71 Fonte.2 18.78,4.41 USB.1 42.32,17.76 Luz.2 45.34,18.77 45.34,32.57 Fluxo1.3 43.29,34.61 43.29,44.05 43.54,44.3 ; 4.94,15.71 4.22,15.71 PH.3 ; 4.94,15.71 5.44,16.22 5.44,31.33 Sonic.2 ; 43.54,44.3 42.28,44.3 36.7,49.87 M1.1 ; 43.54,44.3 OLED.2
GND: length 137
  Top Layer w0.254: Temp.1 3.17,44.38 3.17,35.6 Sonic.1 3.17,33.57 3.17,20.76 PH.1 2.92,18.47 2.92,15.34 7.75,10.51 R9.1 16.64,4.92 ; 16.64,4.92 16.64,4.29 Fonte.1 ; 16.64,4.92 17.15,5.43 29.95,5.43 USB.2 32.97,4.41 Luz.1 45.34,16.77 45.34,28.57 Fluxo1.1 45.34,30.85 45.34,41.28 OLED.1 45.34,43.31 45.34,48.9 39.29,54.95 M1.3
D0: length 31
  Top Layer w0.254: U2.11 15.76,37.16 NOREF#11.1 18.79,36.03 18.79,19.26 R8.2 11.54,12.02 R9.2
DQ: length 25.1
  Top Layer w0.254: U1.1 6.09,47.33 6.09,45.29 Temp.2 ; 7.11,48.35 U2.10 NOREF#14.1
ECHO: length 14.9
  Top Layer w0.254: Sonic.4 12.24,28.58 U2.13 NOREF#12.4
FLUX3.3V: length 7.5
  Top Layer w0.254: R5.1 37.73,33.99 U2.6 NOREF#4.2
SCL: length 40.8
  Top Layer w0.254: NOREF#3.2 U2.5 34.67,34.5 v1(34.67,33.47) 34.93,33.22 39.5,33.22 43.31,37.03 43.31,45.28 OLED.3
  Bottom Layer w0.254: v1(34.67,33.47) 34.67,29.41 Luz.3
SDA: length 40.3
  Top Layer w0.254: 32.77,32.09 32.73,32.09 NOREF#7.3 ; 32.77,32.09 U2.4 44.32,22.31 Luz.4 ; 32.77,32.09 31.5,33.36 31.5,37.5 32.51,38.52 35.81,38.52 43.18,45.89 43.18,47.16 OLED.4
TRIG: length 15.1
  Top Layer w0.254: Sonic.3 11.7,30.58 U2.12 NOREF#15.1
VFLUX: length 5.7
  Top Layer w0.254: Fluxo1.2 43.43,32.48 R5.2
$2N1692: length 4.9
  Top Layer w0.254: R7.2 14.75,18.24 R8.1
$2N3634: length 7.1
  Top Layer w0.254: R7.1 5.2,16.73 PH.2

# Board PCB20
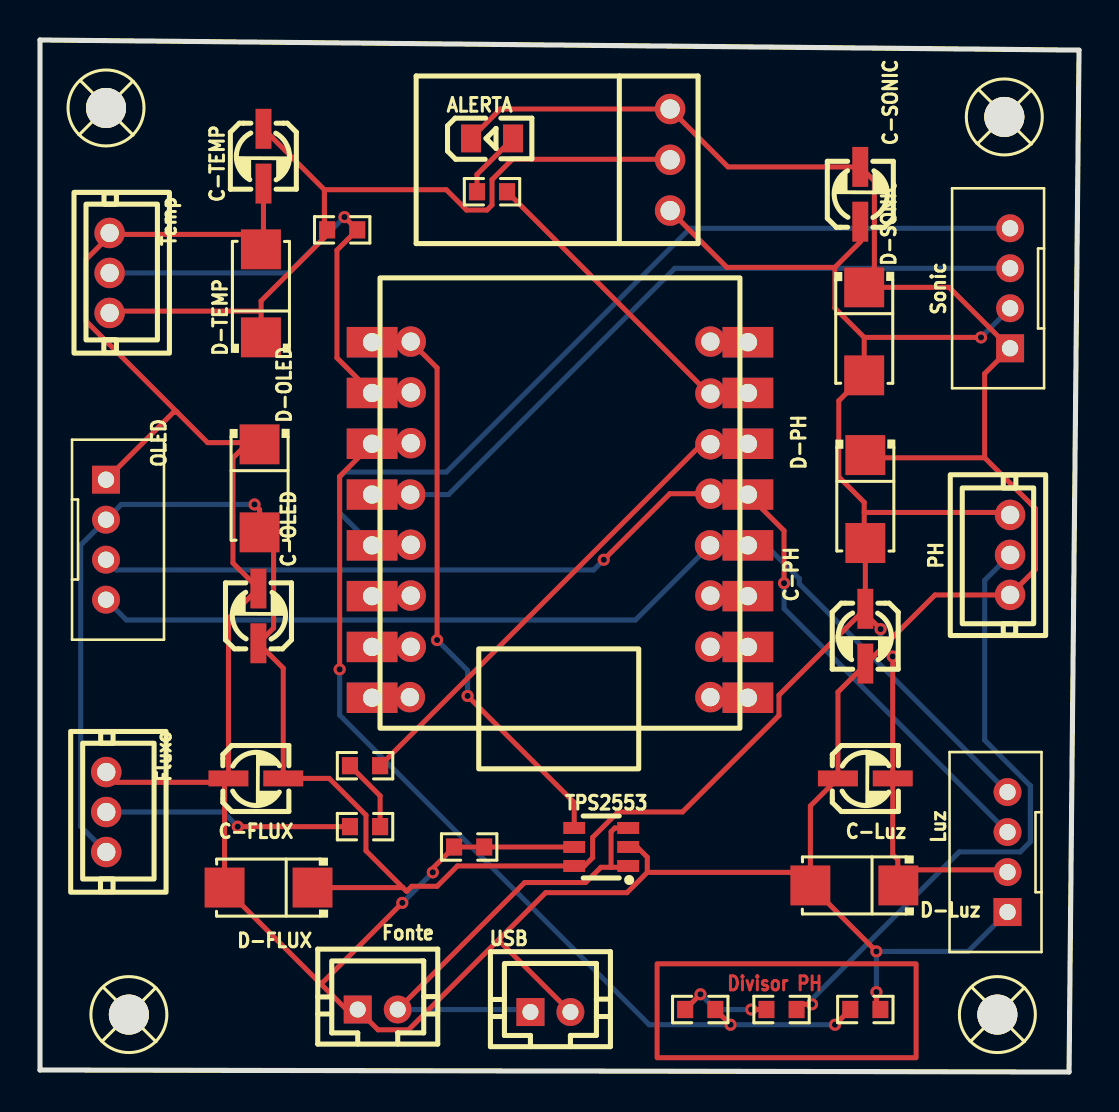
[diagram p5: board, top side]
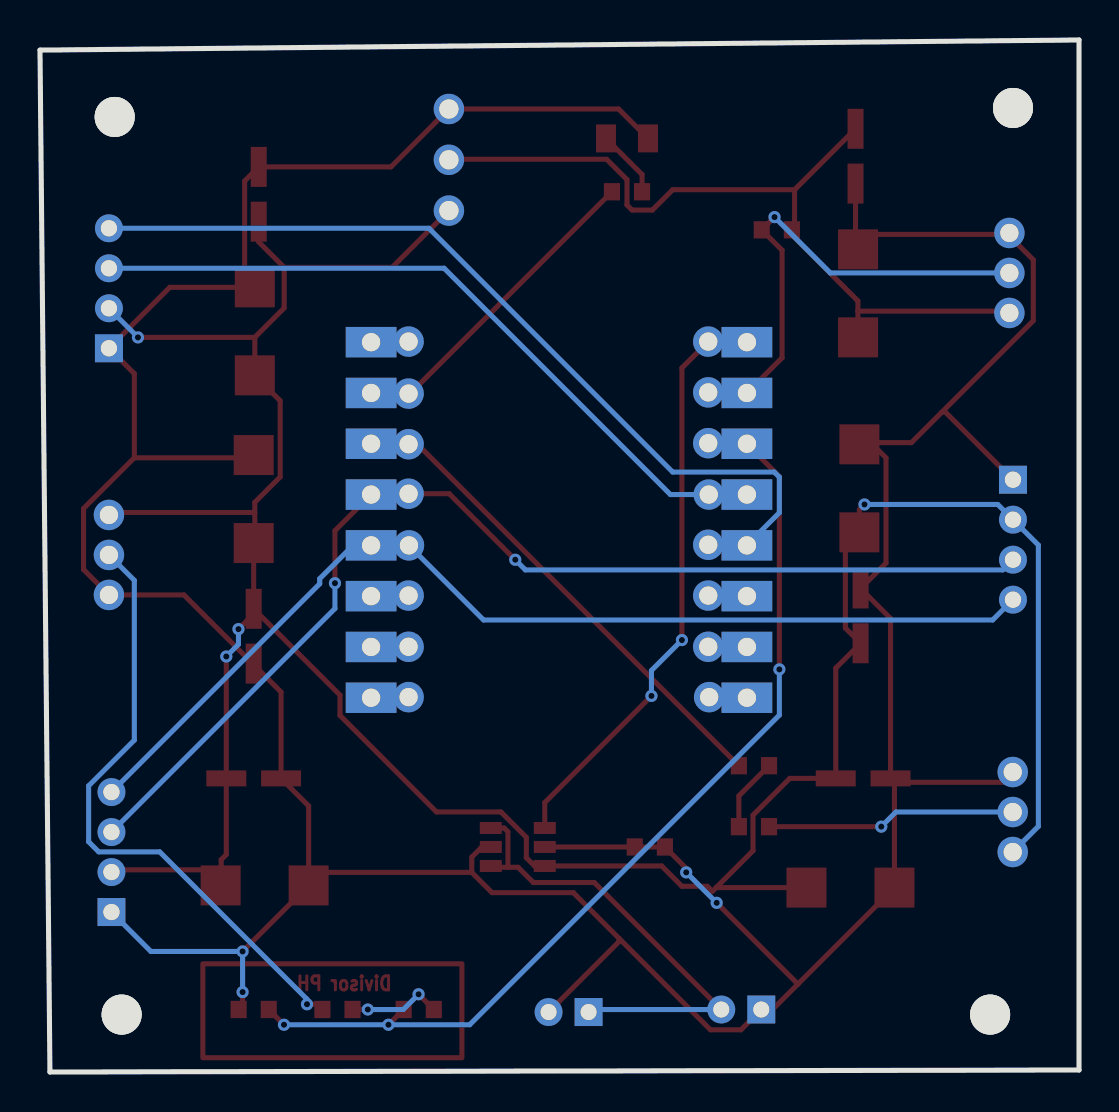
[diagram p6: board, bottom side, seen from below]

Outline 51.96 x 51.61 mm; copper layers: Top Layer, Bottom Layer. Coordinates in mm from the lower left corner of the outline.
Outline path: 0,51.61 51.96,51.1 51.46,0 0,0.1 0,51.61
Stack: Top Layer 0.035mm / Dielectric1 1.51mm FR4 er 4.5 / Bottom Layer 0.035mm

## Design rules (mm)
template: JLCPCB Capability(Two Layers Board)
spacing copperThickness1oz (default): track to track 0.102, other pairs 0.152 to 0.3
spacing copperThickness2oz: track to track 0.203, other pairs 0.152 to 0.3
track width copperThickness1oz (default): min 0.127, default 0.254, max 2.54
track width copperThickness2oz: min 0.203, default 0.254, max 2.54
differential pair differentialPair (default): width min 0.127, default 0.254, max 2.54; gap min 0.152, default 0.152
via viaSize (default): diameter min 0.5, default 0.61, max 10; hole min 0.3, default 0.305, max 6.3

## Placement (name value [footprint] x y rotation side)
ALERTA  -  [LED0805-R-RD]  22.61 46.69 0 top
C-FLUX  100uF  [CAP-SMD_BD3.0-L3.3-W3.3-RD]  10.8 14.68 180 top
C-Luz  100uF  [CAP-SMD_BD3.0-L3.3-W3.3-RD]  41.28 14.68 180 top
C-OLED  100uF  [CAP-SMD_BD3.0-L3.3-W3.3-RD]  10.92 22.81 270 top
C-PH  100uF  [CAP-SMD_BD3.0-L3.3-W3.3-RD]  41.28 21.79 90 top
C-SONIC  100uF  [CAP-SMD_BD3.0-L3.3-W3.3-RD]  41.02 43.89 270 top
C-TEMP  100uF  [CAP-SMD_BD3.0-L3.3-W3.3-RD]  11.18 45.8 90 top
D-FLUX  SMAJ5.0A  [SMA_L4.3-W2.6-LS5.2-RD]  11.43 9.22 180 top
D-Luz  SMAJ5.0A  [SMA_L4.3-W2.6-LS5.2-RD]  40.73 9.33 180 top
D-OLED  SMAJ5.0A  [SMA_L4.3-W2.6-LS5.2-RD]  10.98 29.19 270 top
D-PH  SMAJ5.0A  [SMA_L4.3-W2.6-LS5.2-RD]  41.28 28.65 270 top
D-SONIC  SMAJ5.0A  [SMA_L4.3-W2.6-LS5.2-RD]  41.22 37.04 270 top
D-TEMP  SMAJ5.0A  [SMA_L4.3-W2.6-LS5.2-RD]  11.05 38.94 90 top
Fluxo  WAFER-PH2.0-3PZZ  [CONN-TH_PH2.0D-L-3P]  3.31 13 270 top
Fonte  PH2.0  [CONN-TH_WAFER-PH2.0-2PZZ-Y62]  16.89 3.13 0 top
Luz  PH2.0-4P  [CONN-TH_PH2.0-4P]  48.39 11 90 top
M1  Reg. 3.3v  [AMS1117-3.3 BUCK CONVERTER BREAKOUT]  28.97 45.62 90 top
NOREF  -  [Pad_e1565]  33.53 33.93 0 top
NOREF#2  -  [Pad_e1551]  18.54 36.53 0 top
NOREF#3  -  [Pad_e1562]  18.54 23.83 0 top
NOREF#4  -  [Pad_e1568]  33.51 26.34 0 top
NOREF#5  -  [Pad_e1561]  18.54 26.37 0 top
NOREF#6  -  [Pad_e1563]  18.54 21.26 0 top
NOREF#7  -  [Pad_e1554]  18.54 31.45 0 top
NOREF#8  -  [Pad_e1553]  18.54 33.99 0 top
NOREF#9  -  [Pad_e1567]  33.53 28.92 0 top
NOREF#10  -  [Pad_e1578]  18.5 18.75 0 top
NOREF#11  -  [Pad_e1575]  33.53 21.26 0 top
NOREF#12  -  [Pad_e1564]  33.53 36.53 0 top
NOREF#13  -  [Pad_e1574]  33.53 23.83 0 top
NOREF#14  -  [Pad_e1566]  33.53 31.39 0 top
NOREF#15  -  [Pad_e1577]  33.53 18.75 0 top
NOREF#16  -  [Pad_e1555]  18.52 28.88 0 top
OLED  PH2.0-4P  [CONN-TH_PH2.0-4P]  3.3 26.62 270 top
PH  WAFER-PH2.0-3PZZ  [CONN-TH_PH2.0D-L-3P]  48.51 25.86 90 top
R5  100  [R0603]  16.26 15.32 180 top
R7  220  [R0603]  37.08 3.13 180 top
R8  1.7k  [R0603]  33.02 3.13 0 top
R9  3.7K  [R0603]  41.28 3.13 180 top
R10  100  [R0603]  16.26 12.27 180 top
SCREW1  -  [Screw-Hole-M2]  48.23 47.76 0 top
SCREW2  -  [Screw-Hole-M2]  47.88 2.87 0 top
SCREW3  -  [Screw-Hole-M2]  4.45 2.87 0 top
SCREW4  -  [Screw-Hole-M2]  3.3 48.21 0 top
Sonic  PH2.0-4P  [CONN-TH_PH2.0-4P]  48.51 39.19 90 top
Temp  WAFER-PH2.0-3PZZ  [CONN-TH_PH2.0D-L-3P]  3.48 39.96 270 top
TPS2553  TPS2553DBVR  [SOT-23-6_L2.9-W1.6-P0.95-LS2.8-BR]  28.07 11.25 0 top
U1  4.7K  [R0603]  15.11 42.11 180 top
U2  -  [ESP32-C3-SUPER-MINI]  26.01 26.84 180 top
U3  5.1K  [R0603]  21.46 11.25 0 top
U4  150  [R0603]  22.61 44.02 0 top
USB  PH2.0  [CONN-TH_WAFER-PH2.0-2PZZ-Y62]  25.53 3 0 top

## Footprints (pads in the part's own frame, mm; a bottom-side part is the same pattern mirrored in y, then rotated)
AMS1117-3.3 BUCK CONVERTER BREAKOUT
  round 1.524 hole 0.965: 1(-2.54,-2.54) 2(0,-2.54) 3(2.54,-2.54)
CAP-SMD_BD3.0-L3.3-W3.3-RD
  rect 2x0.8 smd: 1(1.37,0) 2(-1.37,0)
CONN-TH_PH2.0-4P
  rect 1.4x1.4 hole 0.813: 1(-3,0)
  round 1.4 hole 0.813: 2(-1,0) 3(1,0) 4(3,0)
CONN-TH_PH2.0D-L-3P
  round 1.524 hole 0.914: 1(-2,0) 2(0,0) 3(2,0)
CONN-TH_WAFER-PH2.0-2PZZ-Y62
  rect 1.4x1.4 hole 0.8: 1(-1,0)
  round 1.4 hole 0.8: 2(1,0)
ESP32-C3-SUPER-MINI
  rect 2.54x1.524 hole 0.914: 1(-9.398,8.128) 2(-9.398,5.588) 3(-9.398,3.048) 4(-9.398,0.508) 5(-9.398,-2.032) 6(-9.398,-4.572) 7(-9.398,-7.112) 8(-9.398,-9.652) 9(9.398,-9.652) 10(9.398,-7.112) 11(9.398,-4.572) 12(9.398,-2.032) 13(9.398,0.508) 14(9.398,3.048) 15(9.398,5.588) 16(9.398,8.128)
LED0805-R-RD
  rect 1x1.399 smd: 1(1.05,0) 2(-1.05,0)
Pad_e1551
  round 1.524 hole 0.914: 1(0,0)
Pad_e1553
  round 1.524 hole 0.914: 1(0,0)
Pad_e1554
  round 1.524 hole 0.914: 2(0,0)
Pad_e1555
  round 1.524 hole 0.914: 3(0,0)
Pad_e1561
  round 1.524 hole 0.914: 4(0,0)
Pad_e1562
  round 1.524 hole 0.914: 5(0,0)
Pad_e1563
  round 1.524 hole 0.914: 6(0,0)
Pad_e1564
  round 1.524 hole 0.914: 7(0,0)
Pad_e1565
  round 1.524 hole 0.914: 8(0,0)
Pad_e1566
  round 1.524 hole 0.914: 9(0,0)
Pad_e1567
  round 1.524 hole 0.914: 10(0,0)
Pad_e1568
  round 1.524 hole 0.914: 11(0,0)
Pad_e1574
  round 1.524 hole 0.914: 12(0,0)
Pad_e1575
  round 1.524 hole 0.914: 13(0,0)
Pad_e1577
  round 1.524 hole 0.914: 1(0,0)
Pad_e1578
  round 1.524 hole 0.914: 2(0,0)
R0603
  rect 0.806x0.864 smd: 1(-0.753,0) 2(0.753,0)
Screw-Hole-M2
  round 2 hole 2: 1(0,0)
SMA_L4.3-W2.6-LS5.2-RD
  rect 2x2 smd: 1(-2.2,0) 2(2.2,0)
SOT-23-6_L2.9-W1.6-P0.95-LS2.8-BR
  rect 1.1x0.6 smd: 1(1.35,-0.95) 2(1.35,0) 3(1.35,0.95) 4(-1.35,0.95) 5(-1.35,0) 6(-1.35,-0.95)

## Nets
3.3V: C-TEMP.1 D-TEMP.1 M1.2 Temp.3 U1.2
+5V: Fonte.2 TPS2553.1 TPS2553.3 USB.1
+5V-PROT: C-FLUX.2 C-Luz.2 C-OLED.1 C-PH.1 C-SONIC.1 D-FLUX.1 D-Luz.1 D-OLED.2 D-PH.2 D-SONIC.2 Fluxo.3 Luz.2 M1.1 OLED.2 PH.3 Sonic.2 TPS2553.6
GND: ALERTA.2 C-FLUX.1 C-Luz.1 C-OLED.2 C-PH.2 C-SONIC.2 C-TEMP.2 D-FLUX.2 D-Luz.2 D-OLED.1 D-PH.1 D-SONIC.1 D-TEMP.2 Fluxo.1 Fonte.1 Luz.1 M1.3 OLED.1 PH.1 R9.1 Sonic.1 Temp.1 TPS2553.2 TPS2553.5 U3.1 U3.2 USB.2
D0: NOREF#7.2 R8.2 R9.2 U2.11
DQ: NOREF#8.1 Temp.2 U1.1 U2.10
ECHO: NOREF#5.4 Sonic.4 U2.13
FALHA: NOREF#2.1 TPS2553.4 U2.9
FLUX3.3V: NOREF#14.9 R5.1 U2.6
SCL: Luz.3 NOREF#9.10 OLED.3 U2.5
SDA: Luz.4 NOREF#4.11 OLED.4 U2.4
TRIG: NOREF#16.3 Sonic.3 U2.12
VFLUX: Fluxo.2 R10.2
$2N1692: R7.2 R8.1
$2N3634: PH.2 R7.1
$2N15099: NOREF.8 U2.7 U4.2
$2N15124: ALERTA.1 U4.1
$2N15188: R5.2 R10.1

Pads without a net: NOREF#3 5; NOREF#6 6; NOREF#10 2; NOREF#11 13; NOREF#12 7; NOREF#13 12; NOREF#15 1; SCREW1 1; SCREW2 1; SCREW3 1; SCREW4 1; U2 1 2 3 8 14 15 16

## Via types
v1: diameter 0.61, hole 0.305, Top Layer to Bottom Layer, 20 vias

## Routing (per net, layer and track width the routed paths; a pad name or vN(x,y) marks a point on that pad's centre or on a via; arc(x,y) is an arc through that point)
3.3V: length 40.2
  Top Layer w0.254: C-TEMP.1 14.22,44.12 ; 14.22,44.12 14.22,42.25 U1.2 14.36,41.86 11.06,38.56 11.06,38.05 ; 14.22,44.12 20.32,44.12 21.34,43.1 22.35,43.1 22.61,43.36 22.61,44.63 23.62,45.64 31.49,45.64 M1.2 ; Temp.3 3.57,38.05 11.06,38.05 ; D-TEMP.1 11.06,36.75 11.06,38.05
+5V: length 23.9
  Top Layer w0.254: TPS2553.3 28.75,12.2 28.56,12.02 28.56,10.24 ; 28.56,10.24 28.05,10.24 27.29,9.48 24.24,9.48 Fonte.2 ; 28.56,10.24 29.35,10.24 TPS2553.1
  Bottom Layer w0.254: USB.1 24.4,3.13 Fonte.2
+5V-PROT: length 150.7
  Top Layer w0.254: 41.22,27.98 48.39,27.98 PH.3 ; 41.22,27.98 41.22,28.49 39.95,29.76 39.95,33.57 D-SONIC.2 41.22,36.74 ; 41.22,27.98 41.22,26.51 D-PH.2 C-PH.1 ; M1.1 34.35,40.24 39.75,40.24 ; v1(42.65,20.78) C-Luz.2 42.65,10.87 42.9,10.62 42.9,10.11 ; 41.22,36.74 v1(47.06,36.74) ; 41.22,36.74 39.75,38.2 39.75,40.24 ; 18.15,9.22 18.34,9.03 18.59,9.29 19.86,9.29 20.88,10.3 TPS2553.6 27.22,10.3 27.64,10.72 27.64,11.73 28.91,13 32.13,13 36.96,17.83 36.96,18.85 C-PH.1 ; 18.15,9.22 D-FLUX.1 ; 18.15,9.22 16.3,11.07 16.3,12.84 14.46,14.68 C-FLUX.2 12.16,20.2 C-OLED.1 11.68,22.2 11.68,26.29 D-OLED.2 10.98,28.13 v1(10.73,28.38) ; v1(42.04,22.15) 41.28,22.91 C-PH.1 ; C-SONIC.1 41.02,41.51 39.75,40.24 ; Luz.2 48.28,10.11 42.9,10.11 ; 42.9,10.11 42.9,9.36 D-Luz.1
  Bottom Layer w0.254: v1(10.73,28.38) 4.06,28.38 OLED.2 2.03,26.35 2.03,12.28 3.31,11 ; 47.06,36.74 Sonic.2 ; v1(42.04,22.15) 42.04,21.39 v1(42.65,20.78)
GND: length 213.2
  Top Layer w0.254: v1(41.83,4) 41.83,3.49 R9.1 ; 9.23,14.49 C-FLUX.1 9.43,22.68 C-OLED.2 9.65,25.45 9.65,30.71 10.41,31.47 ; 9.23,14.49 3.83,14.49 Fluxo.1 ; 9.23,14.49 D-FLUX.2 14.06,4.4 ; D-Luz.2 37.87,9.98 30.37,9.98 ; D-Luz.2 38.53,13.3 C-Luz.1 39.91,19 41.28,20.37 ; D-Luz.2 v1(41.83,6.03) ; ALERTA.2 23.03,48.16 M1.3 34.41,45.26 C-SONIC.2 41.73,44.56 41.73,39.75 D-SONIC.1 45.47,39.24 Sonic.1 47.24,34.92 47.24,30.72 ; TPS2553.2 29.86,11.25 30.37,10.75 30.37,9.98 ; 10.41,31.47 8.38,31.47 6.86,33 ; 10.41,31.47 10.9,31.47 D-OLED.1 ; 23,6.68 18.43,2.11 16.91,2.11 Fonte.1 15.33,3.13 14.06,4.4 ; 23,6.68 23,6.52 USB.2 ; 23,6.68 25.29,8.97 29.35,8.97 30.37,9.98 ; v1(19.64,9.98) 19.64,10.19 U3.1 U3.2 TPS2553.5 ; 41.28,20.37 44.76,23.86 PH.1 49.78,25.13 49.78,28.18 47.24,30.72 ; 41.28,20.37 C-PH.2 ; 47.24,30.72 41.41,30.72 D-PH.1 ; 6.86,33 2.29,37.57 2.29,40.62 3.56,41.89 ; 6.86,33 6.68,33 OLED.1 ; C-TEMP.2 11.18,41.89 ; 11.18,41.89 11.18,41.27 D-TEMP.2 ; 11.18,41.89 3.56,41.89 ; 14.06,4.4 v1(18.12,8.46) ; 3.56,41.89 Temp.1
  Bottom Layer w0.254: Luz.1 46.42,6.03 v1(41.83,6.03) v1(41.83,4) ; v1(18.12,8.46) v1(19.64,9.98)
D0: length 49.7
  Top Layer w0.254: 16.51,31.31 14.99,29.79 v1(14.99,20.14) ; 16.51,31.31 U2.11 ; 16.51,31.31 18.41,31.31 NOREF#7.2 ; v1(39.76,2.36) R9.2 ; R8.2 v1(34.54,2.36)
  Bottom Layer w0.254: v1(39.76,2.36) v1(34.54,2.36) 30.47,2.36 14.99,17.85 v1(14.99,20.14)
DQ: length 25.1
  Top Layer w0.254: v1(15.23,42.75) U1.1 14.85,41.1 14.85,35.71 U2.10 18.51,33.96 NOREF#8.1
  Bottom Layer w0.254: Temp.2 12.43,39.96 v1(15.23,42.75)
ECHO: length 44.8
  Bottom Layer w0.254: 16.51,26.45 18.46,26.45 NOREF#5.4 ; 16.51,26.45 14.99,27.97 14.99,29.75 15.24,30 20.32,30 32.51,42.19 Sonic.4 ; 16.51,26.45 U2.13
FALHA: length 29.7
  Top Layer w0.254: TPS2553.4 26.72,13.47 v1(21.38,18.81) ; v1(19.86,21.6) 19.86,35.21 NOREF#2.1 16.64,36.53 U2.9
  Bottom Layer w0.254: v1(19.86,21.6) 21.38,20.08 v1(21.38,18.81)
FLUX3.3V: length 25.1
  Top Layer w0.254: R5.1 33.09,31.39 NOREF#14.9 35.38,31.39 U2.6
SCL: length 56.2
  Top Layer w0.254: v1(37.21,24.45) 37.21,27.07 U2.5 33.57,28.88 NOREF#9.10 31.5,28.92 v1(28.19,25.62)
  Bottom Layer w0.254: Luz.3 37.21,23.18 v1(37.21,24.45) ; OLED.3 3.81,25.11 27.69,25.11 v1(28.19,25.62)
SDA: length 52.3
  Bottom Layer w0.254: Luz.4 37.97,24.41 37.97,24.67 36.3,26.34 U2.4 NOREF#4.11 29.78,22.6 4.32,22.6 OLED.4
TRIG: length 36.6
  Bottom Layer w0.254: U2.12 NOREF#16.3 20.43,28.88 31.75,40.19 Sonic.3
VFLUX: length 12.5
  Top Layer w0.254: v1(9.89,12.27) R10.2
  Bottom Layer w0.254: Fluxo.2 9.16,13 v1(9.89,12.27)
$2N1692: length 4.7
  Top Layer w0.254: R7.2 v1(35.57,3.13) ; v1(33.03,3.89) R8.1
  Bottom Layer w0.254: v1(33.03,3.89) 33.79,3.13 v1(35.57,3.13)
$2N3634: length 31.1
  Top Layer w0.254: R7.1 38.1,3.39 v1(38.61,3.39)
  Bottom Layer w0.254: v1(38.61,3.39) 38.61,3.64 45.97,11.01 49.02,11.01 49.53,11.52 49.53,14.31 47.24,16.6 47.24,24.59 PH.2
$2N15099: length 18.1
  Top Layer w0.254: U4.2 33.42,33.96 U2.7
  Bottom Layer w0.254: U2.7 33.56,33.96 NOREF.8
$2N15124: length 3.4
  Top Layer w0.254: ALERTA.1 21.85,44.88 U4.1
$2N15188: length 3.7
  Top Layer w0.254: R5.2 17.01,13.81 R10.1

## Text on the board
Top Layer: Divisor PH
